# EAGLE design VIC-MIDI_v1.0b (EAGLE 7.6.0)
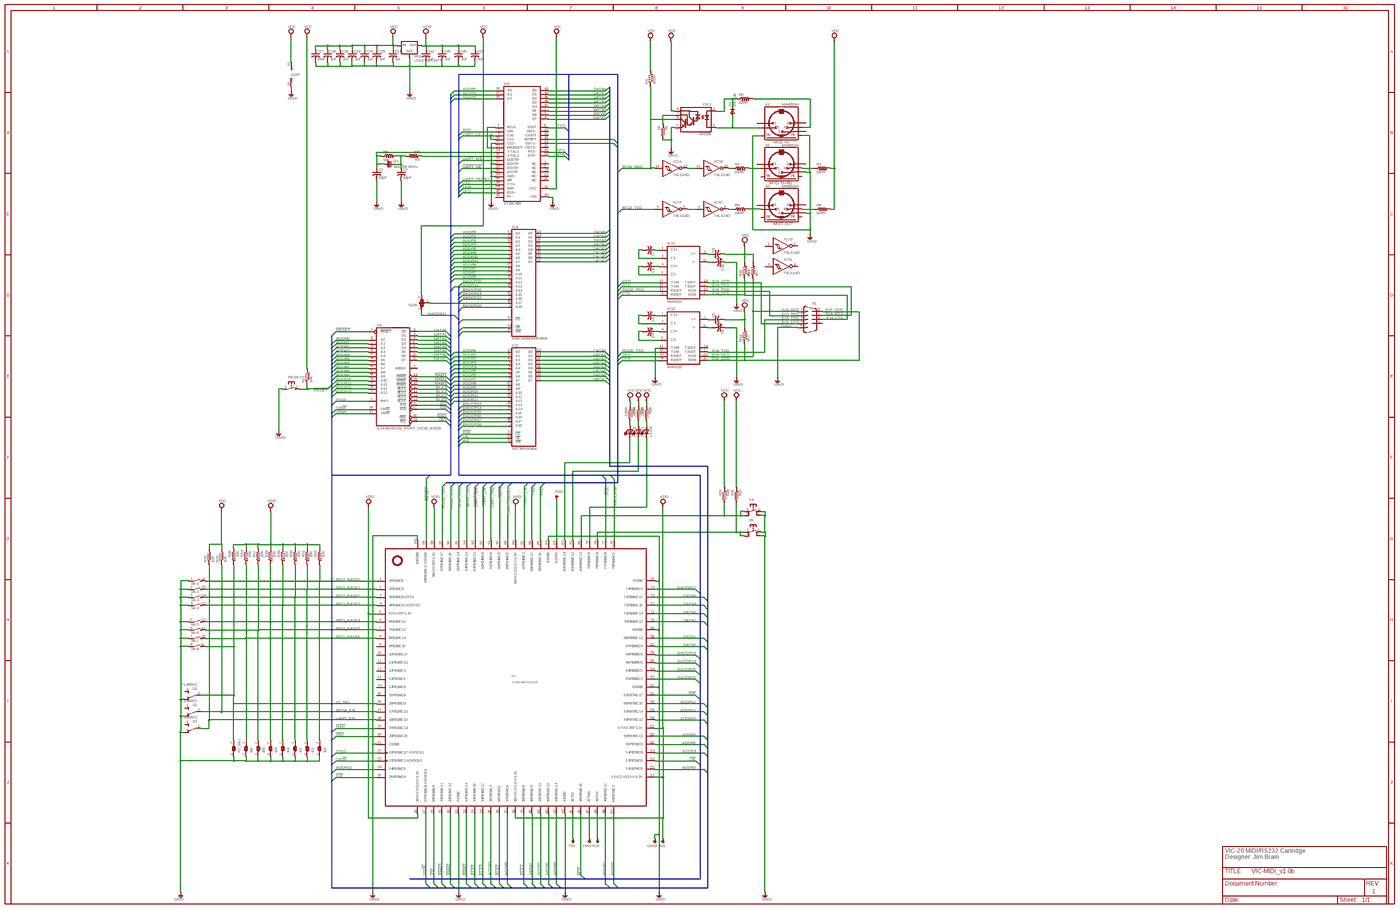
[diagram p0: schematic, sheet 1, overview]
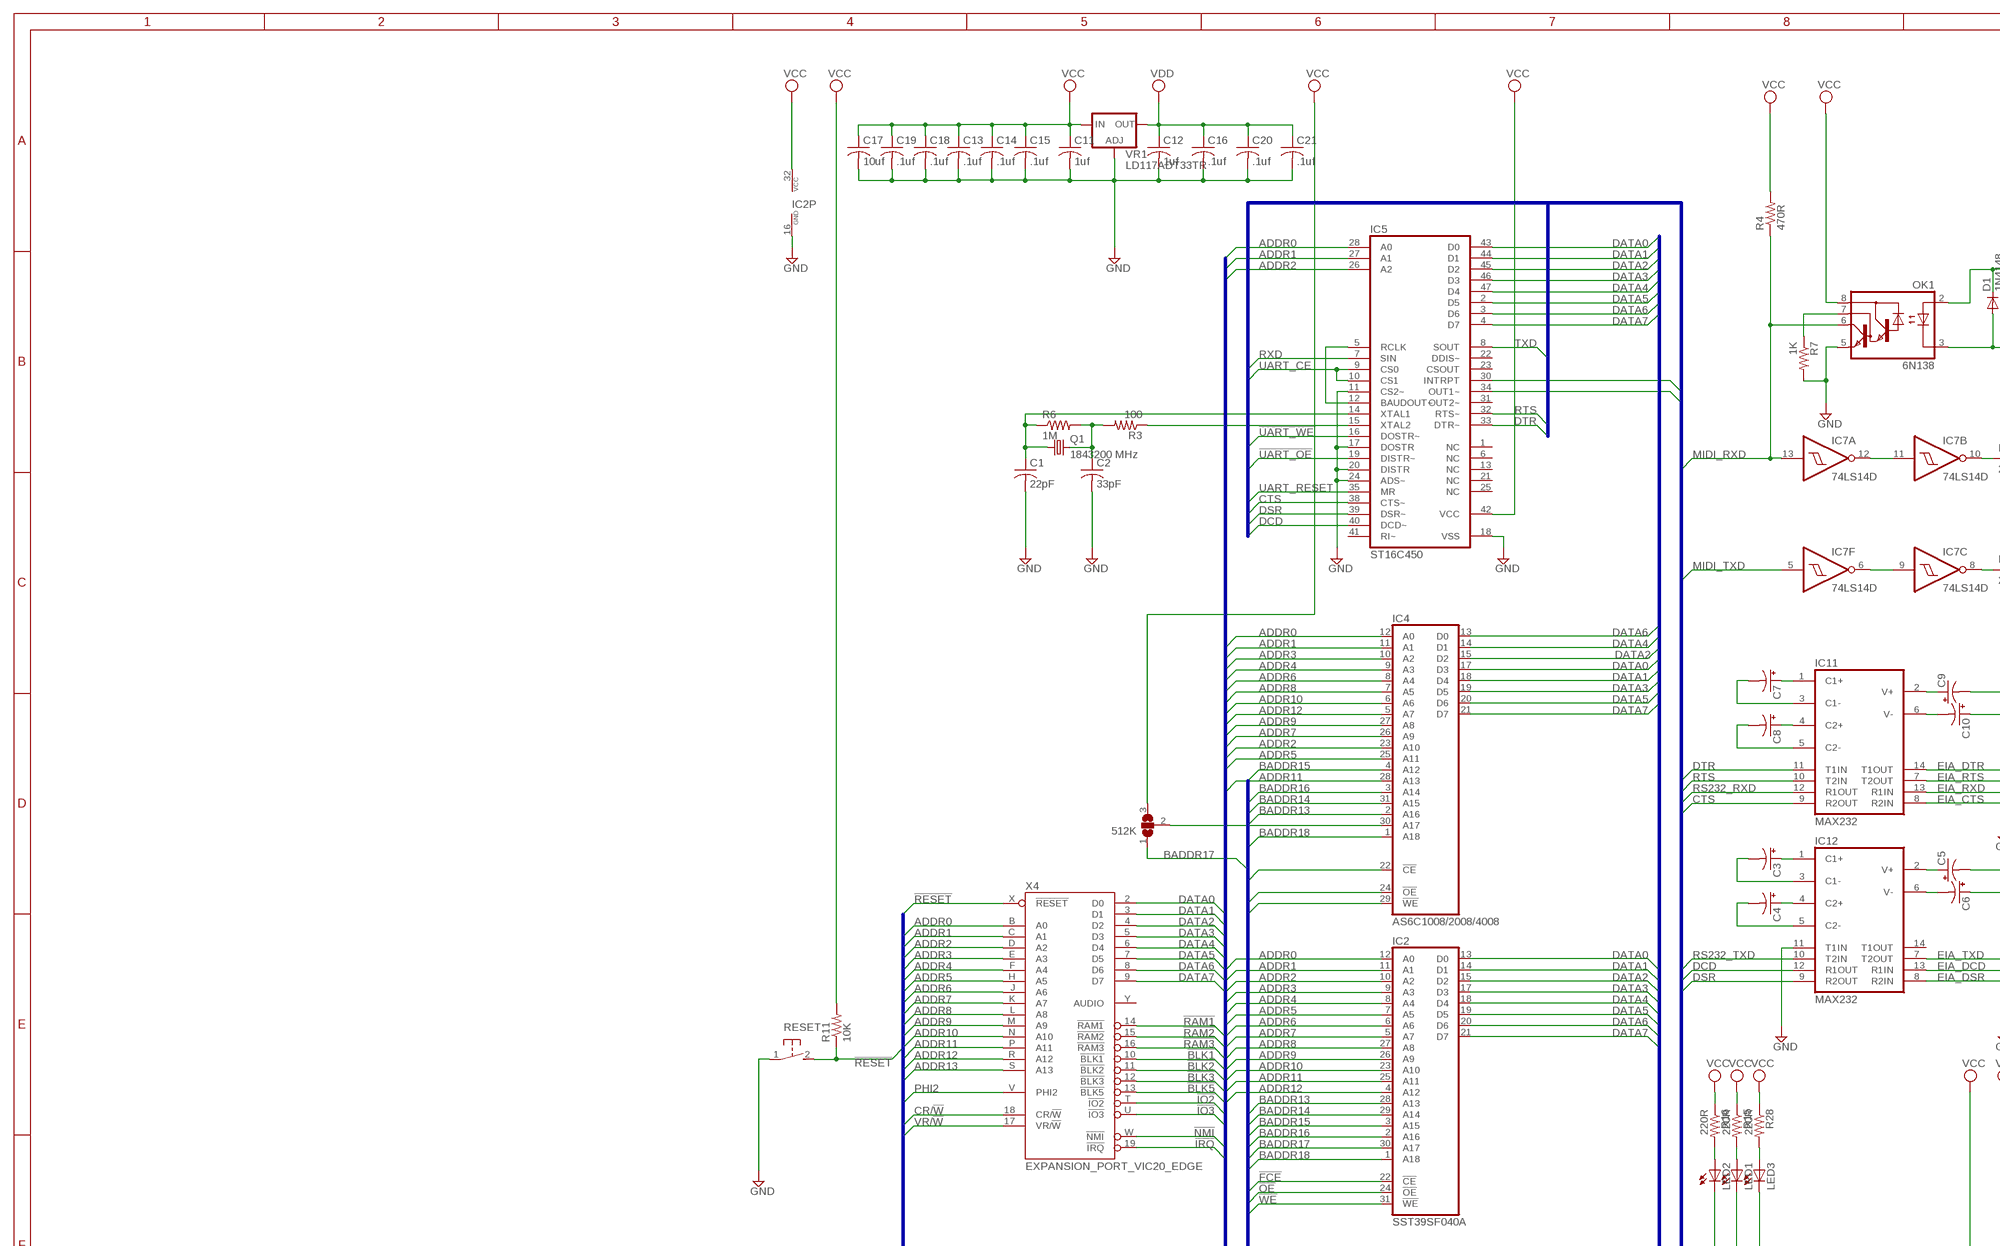
[diagram p1: schematic, sheet 1, part 1 of 4]
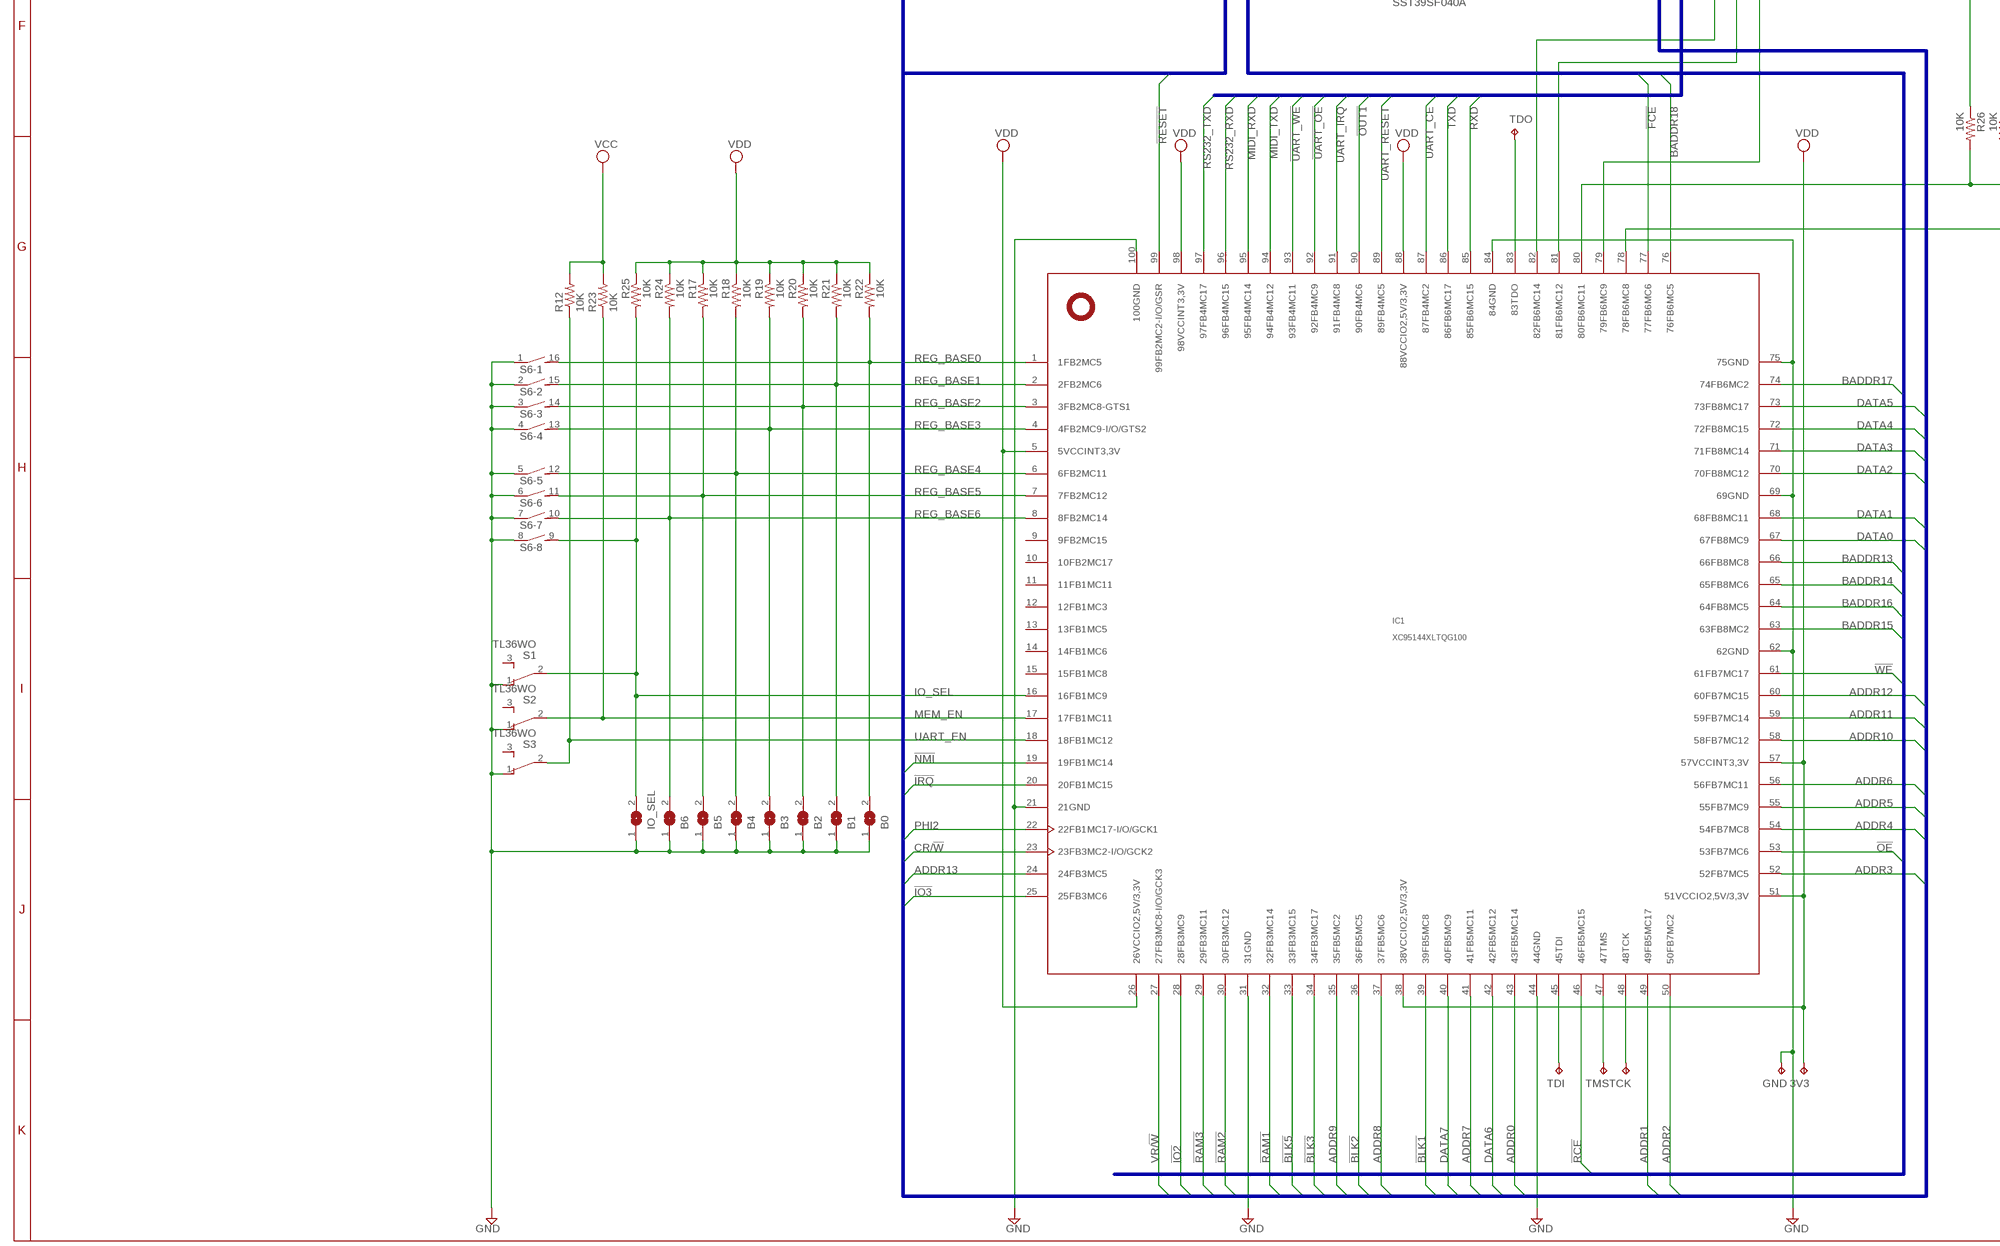
[diagram p2: schematic, sheet 1, part 2 of 4]
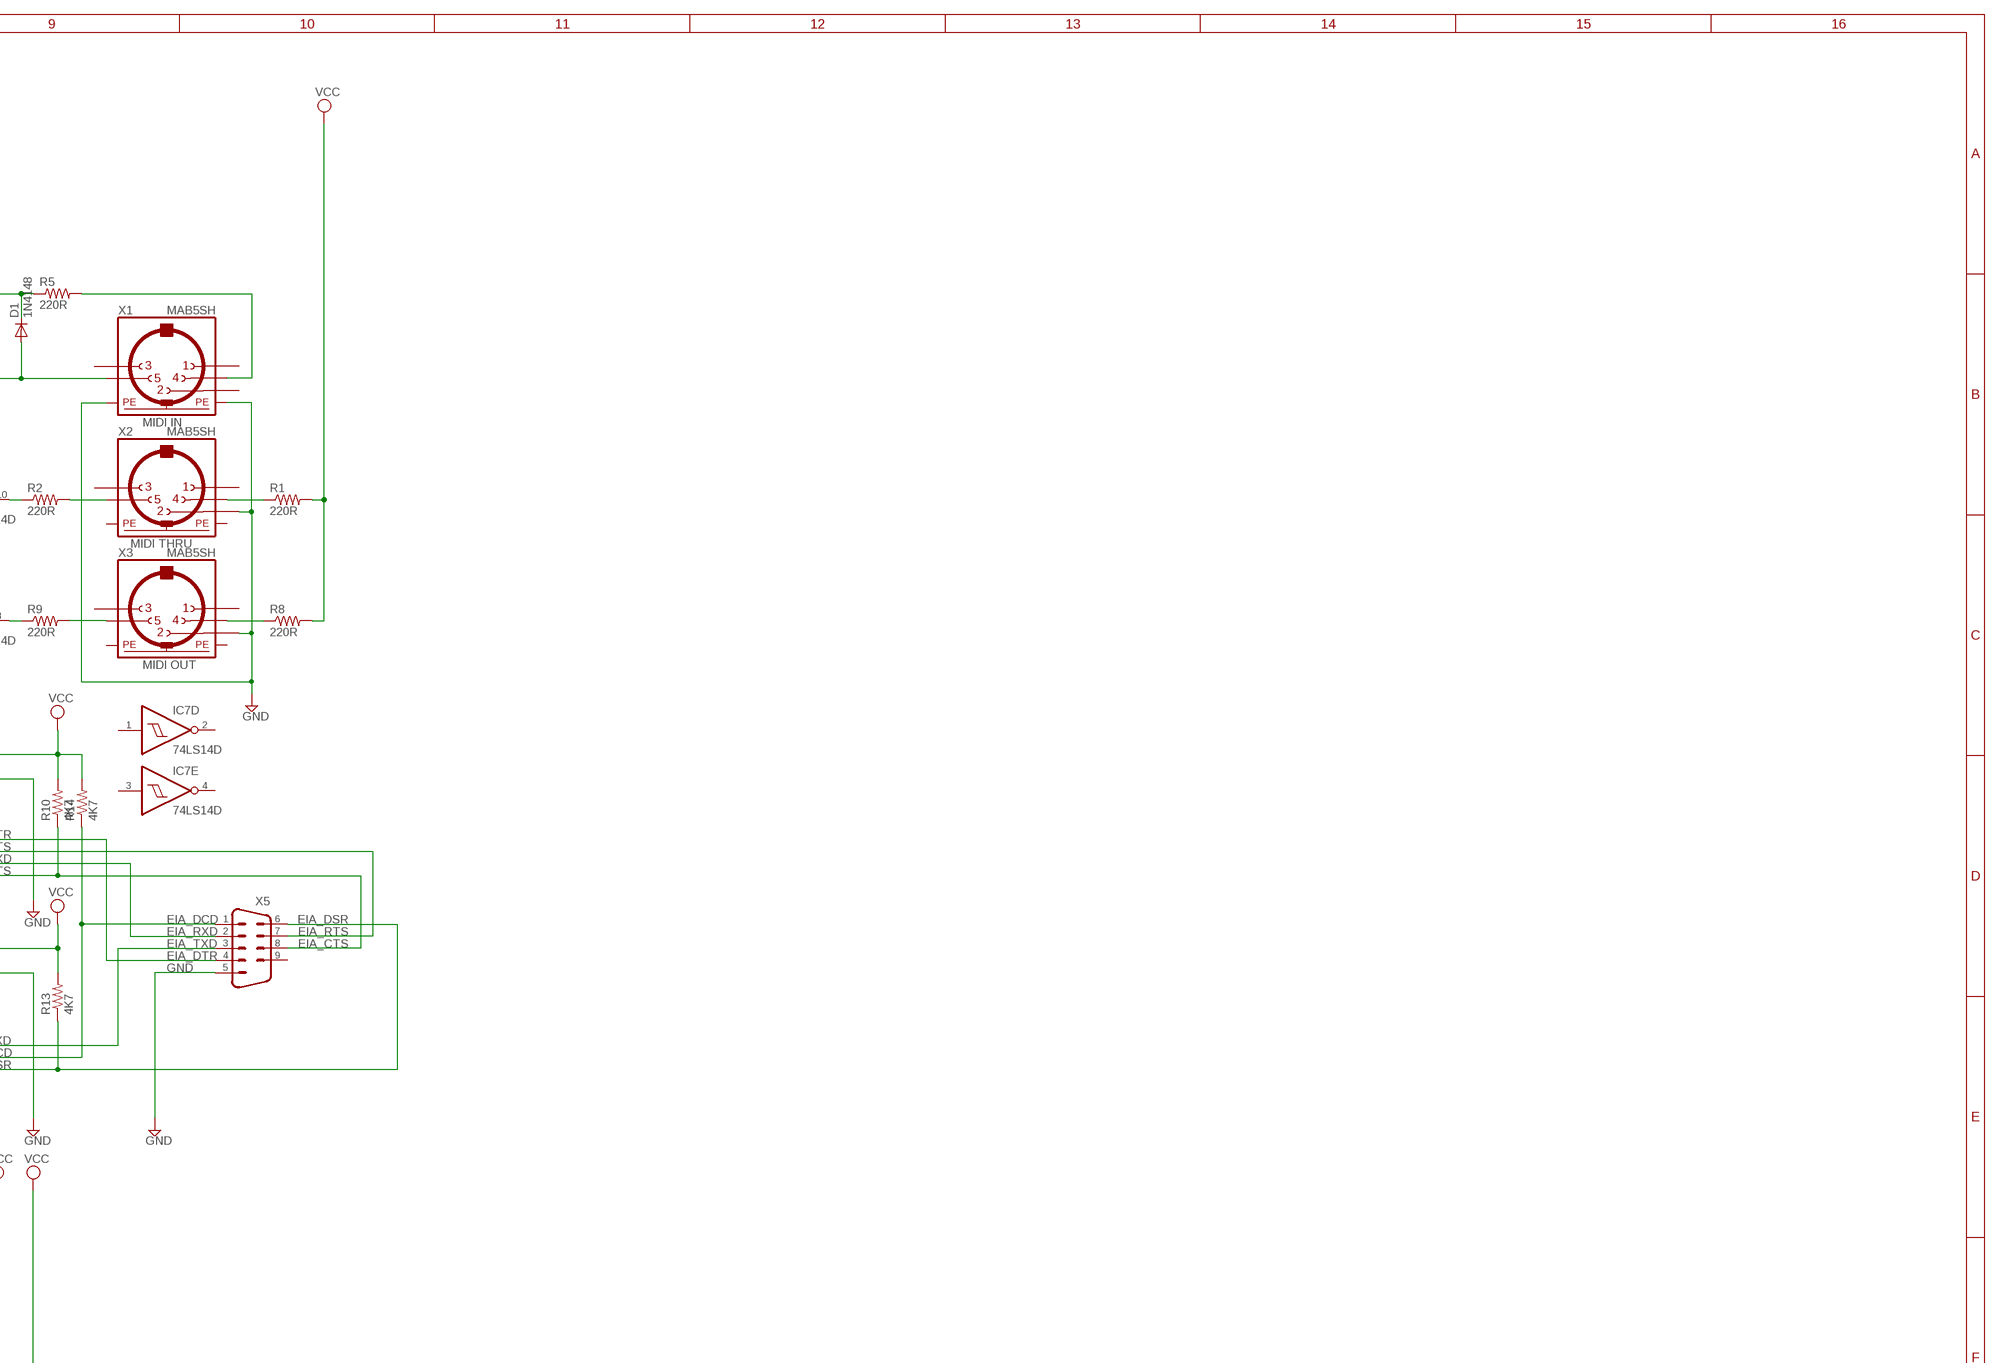
[diagram p3: schematic, sheet 1, part 3 of 4]
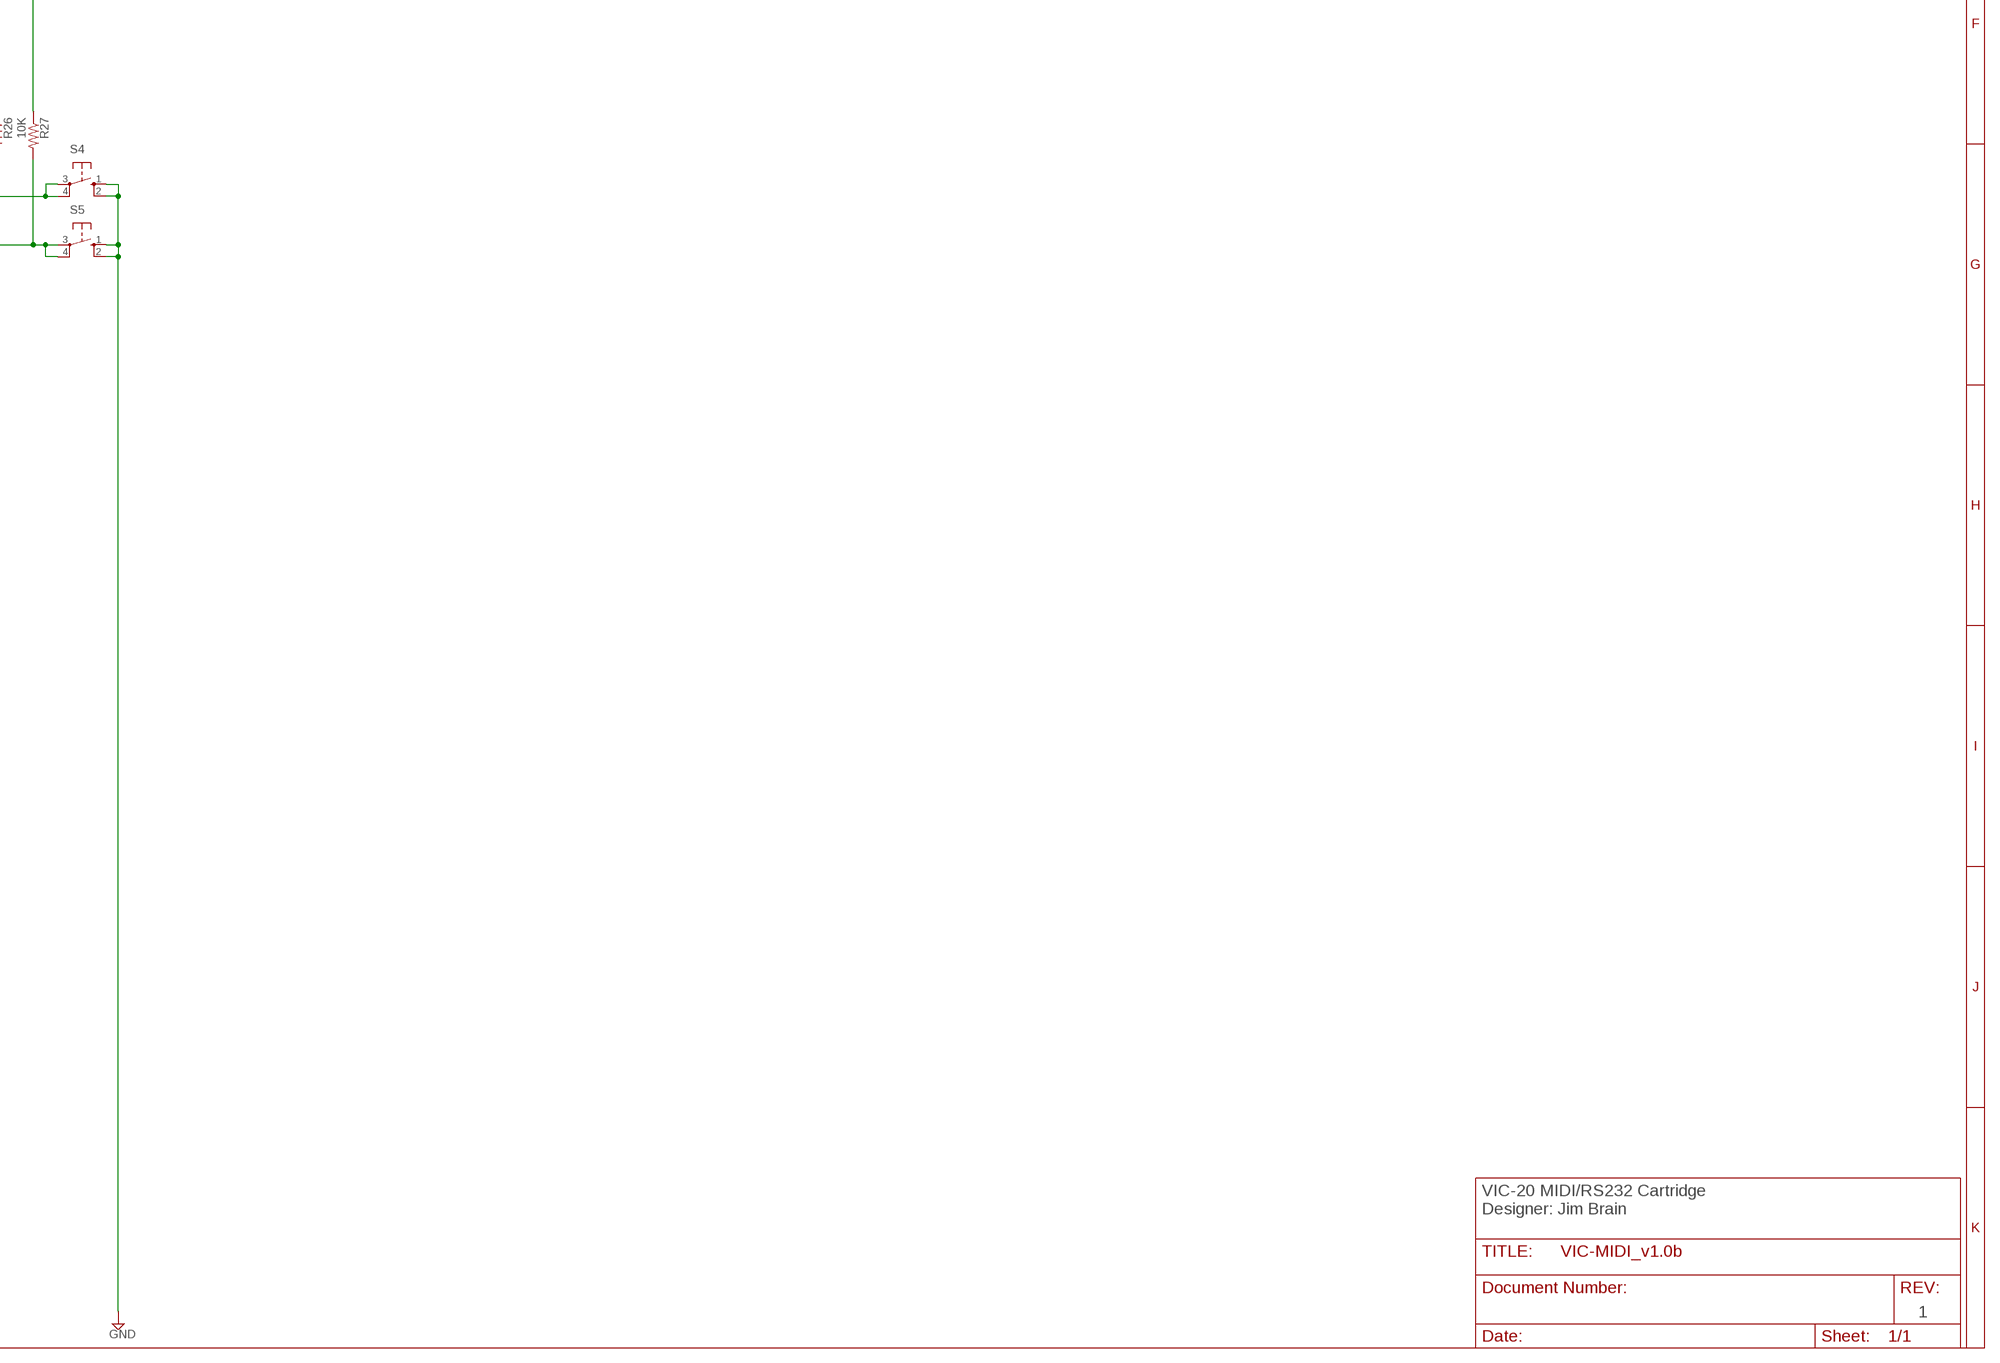
[diagram p4: schematic, sheet 1, part 4 of 4]

## Parts
3V3  TPTP08R  [TP08R]
512K  SJ2W  [SJ_2]
B0  SJ  [SJ]
B1  SJ  [SJ]
B2  SJ  [SJ]
B3  SJ  [SJ]
B4  SJ  [SJ]
B5  SJ  [SJ]
B6  SJ  [SJ]
C1  22pF  C-USC0402  [C0402]
C2  33pF  C-USC0402  [C0402]
C3  CPOL-USE2-4  [E2-4]
C4  CPOL-USE2-4  [E2-4]
C5  CPOL-USE2-4  [E2-4]
C6  CPOL-USE2-4  [E2-4]
C7  CPOL-USE2-4  [E2-4]
C8  CPOL-USE2-4  [E2-4]
C9  CPOL-USE2-4  [E2-4]
C10  CPOL-USE2-4  [E2-4]
C11  1uf  C-USC0402  [C0402]
C12  1uf  C-USC0402  [C0402]
C13  .1uf  C-USC0402  [C0402]
C14  .1uf  C-USC0402  [C0402]
C15  .1uf  C-USC0402  [C0402]
C16  .1uf  C-USC0402  [C0402]
C17  10uf  C-USC0402  [C0402]
C18  .1uf  C-USC0402  [C0402]
C19  .1uf  C-USC0402  [C0402]
C20  .1uf  C-USC0402  [C0402]
C21  .1uf  C-USC0402  [C0402]
D1  1N4148  1N4148DO35-7  [DO35-7]
GND  TPTP08R  [TP08R]
IC1  XC95144XLTQG100  [TQFP100]
IC2  SST39SF040A  AM29F040J  [PLCC32R]
IC4  AS6C1008/2008/4008  AS6C4008  [SOP32L]
IC5  ST16C450  XR-16C450Q  [TQFP48]
IC7  74LS14D  [SO14]
IC11  MAX232  [DIL16]
IC12  MAX232  [DIL16]
IO_SEL  SJ  [SJ]
LED1  LED3MM  [LED3MM]
LED2  LED3MM  [LED3MM]
LED3  LED3MM  [LED3MM]
OK1  6N138  [DIL08]
Q1  1843200 MHz  CRYSTALHC49UP  [HC49UP]
R1  220R  R-US_R0402  [R0402]
R2  220R  R-US_R0402  [R0402]
R3  100  R-US_R0402  [R0402]
R4  470R  R-US_R0402  [R0402]
R5  220R  R-US_R0402  [R0402]
R6  1M  R-US_R0402  [R0402]
R7  1K  R-US_R0402  [R0402]
R8  220R  R-US_R0402  [R0402]
R9  220R  R-US_R0402  [R0402]
R10  4K7  R-US_R0402  [R0402]
R11  10K  R-US_R0402  [R0402]
R12  10K  R-US_R0402  [R0402]
R13  4K7  R-US_R0402  [R0402]
R14  4K7  R-US_R0402  [R0402]
R15  220R  R-US_R0402  [R0402]
R16  220R  R-US_R0402  [R0402]
R17  10K  R-US_R0402  [R0402]
R18  10K  R-US_R0402  [R0402]
R19  10K  R-US_R0402  [R0402]
R20  10K  R-US_R0402  [R0402]
R21  10K  R-US_R0402  [R0402]
R22  10K  R-US_R0402  [R0402]
R23  10K  R-US_R0402  [R0402]
R24  10K  R-US_R0402  [R0402]
R25  10K  R-US_R0402  [R0402]
R26  10K  R-US_R0402  [R0402]
R27  10K  R-US_R0402  [R0402]
R28  220R  R-US_R0402  [R0402]
RESET  31-XX  [B3F-31XX]
S1  TL36WO  [TL3XWO]
S2  TL36WO  [TL3XWO]
S3  TL36WO  [TL3XWO]
S4  10-XX  [B3F-10XX]
S5  10-XX  [B3F-10XX]
S6  DIP08SB  [DIP08SB]
TCK  TPTP08R  [TP08R]
TDI  TPTP08R  [TP08R]
TDO  TPTP08R  [TP08R]
TMS  TPTP08R  [TP08R]
VR1  LD117ADT33TR  [DPACK]
X1  MAB5SH  [MAB5SH]
X2  MAB5SH  [MAB5SH]
X3  MAB5SH  [MAB5SH]
X4  EXPANSION_PORT_VIC20_EDGE  [MA156-22-2]
X5  M09HP  [M09HP]

## Nets
!BLK1: IC1.39(39FB5MC8) X4.10(!BLK1)
!BLK2: IC1.36(36FB5MC5) X4.11(!BLK2)
!BLK3: IC1.34(34FB3MC17) X4.12(!BLK3)
!BLK5: IC1.33(33FB3MC15) X4.13(!BLK5)
!FCE: IC1.77(77FB6MC6) IC2.22(!CE)
!IO2: IC1.28(28FB3MC9) X4.T(!IO2)
!IO3: IC1.25(25FB3MC6) X4.U(!IO3)
!IRQ: IC1.20(20FB1MC15) X4.19(!IRQ)
!NMI: IC1.19(19FB1MC14) X4.W(!NMI)
!OE: IC1.53(53FB7MC6) IC2.24(!OE) IC4.24(!OE)
!OUT1: IC1.90(90FB4MC6) IC5.34(OUT1~)
!RAM1: IC1.32(32FB3MC14) X4.14(!RAM1)
!RAM2: IC1.30(30FB3MC12) X4.15(!RAM2)
!RAM3: IC1.29(29FB3MC11) X4.16(!RAM3)
!RCE: IC1.46(46FB5MC15) IC4.22(!CE)
!RESET: IC1.99(99FB2MC2-I/O/GSR) R11.1 RESET.2(S) X4.X(!RESET)
!UART_OE: IC1.92(92FB4MC9) IC5.19(DISTR~)
!UART_WE: IC1.93(93FB4MC11) IC5.16(DOSTR~)
!WE: IC1.61(61FB7MC17) IC2.31(!WE) IC4.29(!WE)
ADDR0: IC1.43(43FB5MC14) IC2.12(A0) IC4.12(A0) IC5.28(A0) X4.B(A0)
ADDR1: IC1.49(49FB5MC17) IC2.11(A1) IC4.11(A1) IC5.27(A1) X4.C(A1)
ADDR2: IC1.50(50FB7MC2) IC2.10(A2) IC4.23(A10) IC5.26(A2) X4.D(A2)
ADDR3: IC1.52(52FB7MC5) IC2.9(A3) IC4.10(A2) X4.E(A3)
ADDR4: IC1.54(54FB7MC8) IC2.8(A4) IC4.9(A3) X4.F(A4)
ADDR5: IC1.55(55FB7MC9) IC2.7(A5) IC4.25(A11) X4.H(A5)
ADDR6: IC1.56(56FB7MC11) IC2.6(A6) IC4.8(A4) X4.J(A6)
ADDR7: IC1.41(41FB5MC11) IC2.5(A7) IC4.26(A9) X4.K(A7)
ADDR8: IC1.37(37FB5MC6) IC2.27(A8) IC4.7(A5) X4.L(A8)
ADDR9: IC1.35(35FB5MC2) IC2.26(A9) IC4.27(A8) X4.M(A9)
ADDR10: IC1.58(58FB7MC12) IC2.23(A10) IC4.6(A6) X4.N(A10)
ADDR11: IC1.59(59FB7MC14) IC2.25(A11) IC4.28(A13) X4.P(A11)
ADDR12: IC1.60(60FB7MC15) IC2.4(A12) IC4.5(A7) X4.R(A12)
ADDR13: IC1.24(24FB3MC5) X4.S(A13)
BADDR13: IC1.66(66FB8MC8) IC2.28(A13) IC4.2(A16)
BADDR14: IC1.65(65FB8MC6) IC2.29(A14) IC4.31(A15)
BADDR15: IC1.63(63FB8MC2) IC2.3(A15) IC4.4(A12)
BADDR16: IC1.64(64FB8MC5) IC2.2(A16) IC4.3(A14)
BADDR17: 512K.1 IC1.74(74FB6MC2) IC2.30(A17)
BADDR18: IC1.76(76FB6MC5) IC2.1(A18) IC4.1(A18)
CR/!W: IC1.23(23FB3MC2-I/O/GCK2) X4.18(CR/!W)
CTS: IC5.38(CTS~) IC11.9(R2OUT)
DATA0: IC1.67(67FB8MC9) IC2.13(D0) IC4.17(D3) IC5.43(D0) X4.2(D0)
DATA1: IC1.68(68FB8MC11) IC2.14(D1) IC4.18(D4) IC5.44(D1) X4.3(D1)
DATA2: IC1.70(70FB8MC12) IC2.15(D2) IC4.15(D2) IC5.45(D2) X4.4(D2)
DATA3: IC1.71(71FB8MC14) IC2.17(D3) IC4.19(D5) IC5.46(D3) X4.5(D3)
DATA4: IC1.72(72FB8MC15) IC2.18(D4) IC4.14(D1) IC5.47(D4) X4.6(D4)
DATA5: IC1.73(73FB8MC17) IC2.19(D5) IC4.20(D6) IC5.2(D5) X4.7(D5)
DATA6: IC1.42(42FB5MC12) IC2.20(D6) IC4.13(D0) IC5.3(D6) X4.8(D6)
DATA7: IC1.40(40FB5MC9) IC2.21(D7) IC4.21(D7) IC5.4(D7) X4.9(D7)
DCD: IC5.40(DCD~) IC12.12(R1OUT)
DSR: IC5.39(DSR~) IC12.9(R2OUT)
DTR: IC5.33(DTR~) IC11.11(T1IN)
EIA_CTS: IC11.8(R2IN) R10.1 X5.8
EIA_DCD: IC12.13(R1IN) R14.1 X5.1
EIA_DSR: IC12.8(R2IN) R13.1 X5.6
EIA_DTR: IC11.14(T1OUT) X5.4
EIA_RTS: IC11.7(T2OUT) X5.7
EIA_RXD: IC11.13(R1IN) X5.2
EIA_TXD: IC12.7(T2OUT) X5.3
GND: B0.1 B1.1 B2.1 B3.1 B4.1 B5.1 B6.1 C1.2 C2.2 C6.+ C10.+ C11.2 C12.2 C13.2 C14.2 C15.2 C16.2 C17.2 C18.2 C19.2 C20.2 C21.2 GND.TP IC1.21(21GND) IC1.31(31GND) IC1.44(44GND) IC1.62(62GND) IC1.69(69GND) IC1.75(75GND) IC1.84(84GND) IC1.100(100GND) IC2.16(GND) IC5.11(CS2~) IC5.17(DOSTR) IC5.18(VSS) IC5.20(DISTR) IC5.24(ADS~) IC12.11(T1IN) IO_SEL.1 OK1.5(GND) R7.2 RESET.1(P) S1.1(O) S2.1(O) S3.1(O) S4.1(S) S4.2(S1) S5.1(S) S5.2(S1) S6.1 S6.2 S6.3 S6.4 S6.5 S6.6 S6.7 S6.8 VR1.1(ADJ) X1.PE X1.PE@(PE) X2.2 X3.2 X5.5
IO_SEL: IC1.16(16FB1MC9) IO_SEL.2 R25.2 S1.2(P) S6.9
MEM_EN: IC1.17(17FB1MC11) R23.1 S2.2(P)
MIDI_RXD: IC1.95(95FB4MC14) IC7.13(A:I) OK1.6(VO) R4.1
MIDI_TXD: IC1.94(94FB4MC12) IC7.5(F:I)
N$1: R9.2 X3.5
N$2: IC7.6(F:O) IC7.9(C:I)
N$3: R8.1 X3.4
N$4: IC7.8(C:O) R9.1
N$5: LED1.A R15.2
N$6: D1.C OK1.2(A) R5.1
N$7: R5.2 X1.4
N$8: D1.A OK1.3(C) X1.5
N$9: OK1.7(VB) R7.1
N$10: R2.2 X2.5
N$11: IC7.10(B:O) R2.1
N$12: IC7.11(B:I) IC7.12(A:O)
N$13: R1.1 X2.4
N$14: IC1.78(78FB6MC8) R27.2 S5.3(P) S5.4(P1)
N$15: IC5.15(XTAL2) R3.1
N$16: C1.1 IC5.14(XTAL1) Q1.1 R6.1
N$17: C2.1 Q1.2 R3.2 R6.2
N$18: IC1.81(81FB6MC12) LED1.K(C)
N$19: IC5.5(RCLK) IC5.12(BAUDOUT~)
N$20: IC1.80(80FB6MC11) R26.2 S4.3(P) S4.4(P1)
N$21: IC1.82(82FB6MC14) LED2.K(C)
N$22: LED3.A R28.2
N$23: IC1.79(79FB6MC9) LED3.K(C)
N$25: LED2.A R16.2
N$27: IC1.48(48TCK) TCK.TP
N$31: IC1.47(47TMS) TMS.TP
N$32: IC1.45(45TDI) TDI.TP
N$33: IC1.83(83TDO) TDO.TP
N$36: C3.+ IC12.1(C1+)
N$37: C3.- IC12.3(C1-)
N$38: C4.+ IC12.4(C2+)
N$39: C4.- IC12.5(C2-)
N$40: C5.+ IC12.2(V+)
N$41: C6.- IC12.6(V-)
N$42: C7.+ IC11.1(C1+)
N$43: C7.- IC11.3(C1-)
N$44: C8.+ IC11.4(C2+)
N$45: C8.- IC11.5(C2-)
N$46: C9.+ IC11.2(V+)
N$47: C10.- IC11.6(V-)
N$48: 512K.2 IC4.30(A17)
PHI2: IC1.22(22FB1MC17-I/O/GCK1) X4.V(PHI2)
REG_BASE0: B0.2 IC1.1(1FB2MC5) R22.2 S6.16
REG_BASE1: B1.2 IC1.2(2FB2MC6) R21.2 S6.15
REG_BASE2: B2.2 IC1.3(3FB2MC8-GTS1) R20.2 S6.14
REG_BASE3: B3.2 IC1.4(4FB2MC9-I/O/GTS2) R19.2 S6.13
REG_BASE4: B4.2 IC1.6(6FB2MC11) R18.2 S6.12
REG_BASE5: B5.2 IC1.7(7FB2MC12) R17.2 S6.11
REG_BASE6: B6.2 IC1.8(8FB2MC14) R24.2 S6.10
RS232_RXD: IC1.96(96FB4MC15) IC11.12(R1OUT)
RS232_TXD: IC1.97(97FB4MC17) IC12.10(T2IN)
RTS: IC5.32(RTS~) IC11.10(T2IN)
RXD: IC1.85(85FB6MC15) IC5.7(SIN)
TXD: IC1.86(86FB6MC17) IC5.8(SOUT)
UART_CE: IC1.87(87FB4MC2) IC5.9(CS0) IC5.10(CS1)
UART_EN: IC1.18(18FB1MC12) R12.1 S3.2(P)
UART_IRQ: IC1.91(91FB4MC8) IC5.30(INTRPT)
UART_RESET: IC1.89(89FB4MC5) IC5.35(MR)
VCC: 512K.3 C5.- C9.- C11.1 C13.1 C14.1 C15.1 C17.1 C18.1 C19.1 IC2.32(VCC) IC5.42(VCC) OK1.8(VCC) R1.2 R4.2 R8.2 R10.2 R11.2 R12.2 R13.2 R14.2 R15.1 R16.1 R23.2 R26.1 R27.1 R28.1 VR1.3(IN)
VDD: 3V3.TP C12.1 C16.1 C20.1 C21.1 IC1.5(5VCCINT3,3V) IC1.26(26VCCIO2,5V/3,3V) IC1.38(38VCCIO2,5V/3,3V) IC1.51(51VCCIO2,5V/3,3V) IC1.57(57VCCINT3,3V) IC1.88(88VCCIO2,5V/3,3V) IC1.98(98VCCINT3,3V) R17.1 R18.1 R19.1 R20.1 R21.1 R22.1 R24.1 R25.1 VR1.4(OUT)
VR/!W: IC1.27(27FB3MC8-I/O/GCK3) X4.17(VR/!W)
Unconnected: IC1.9(9FB2MC15) IC1.10(10FB2MC17) IC1.11(11FB1MC11) IC1.12(12FB1MC3) IC1.13(13FB1MC5) IC1.14(14FB1MC6) IC1.15(15FB1MC8) IC5.1(NC) IC5.6(NC) IC5.13(NC) IC5.21(NC) IC5.22(DDIS~) IC5.23(CSOUT) IC5.25(NC) IC5.31(OUT2~) IC5.41(RI~) IC7.1(D:I) IC7.2(D:O) IC7.3(E:I) IC7.4(E:O) IC12.14(T1OUT) S1.3(S) S2.3(S) S3.3(S) X1.1 X1.2 X1.3 X2.1 X2.3 X3.1 X3.3 X4.Y(AUDIO) X5.9

## Buses
DATA[0..7],ADDR[0..13],VR/!W,CR/!W,!BLK1,!BLK2,!BLK3,!BLK5,!RAM1,!RAM2,!RAM3,!IRQ,!NMI,!IO2,!IO3,PHI2,!RESET
RXD,TXD,DCD,RTS,CTS,DSR,DTR,MIDI_RXD,MIDI_TXD,RS232_RXD,RS232_TXD,UART_CE,!UART_WE,!UART_OE,UART_RESET,!OUT1,UART_IRQ
BADDR[13..19],!FCE,!OE,!WE,!RCE

## Notes on the sheet
- MIDI IN
- MIDI THRU
- MIDI OUT
- VIC-20 MIDI/RS232 Cartridge
- Designer: Jim Brain
- 1

## Power pins joined to a net without a drawn wire
GND: IC4.16(GND) IC7.7(P:GND) IC11.15(GND) IC12.15(GND) X4.1(GND) X4.22(GND) X4.A(GND) X4.Z(GND)
PE: X2.PE X2.PE@(PE) X3.PE X3.PE@(PE)
VCC: IC4.32(VCC) IC7.14(P:VCC) IC11.16(VCC) IC12.16(VCC) X4.21(VCC)

## Library data of the parts
3V3 GND TCK TDI TDO TMS = testpad:TP: Test pad
512K = jumper:SJ2W: SMD solder JUMPER
B0 B1-B6 IO_SEL = jumper:SJ: SMD solder JUMPER
C1 C2 C11-C21 = rcl:C-US: CAPACITOR, American symbol
C3-C10 = rcl:CPOL-US: POLARIZED CAPACITOR, American symbol
D1 = diode:1N4148: DIODE high speed (Philips)
IC1 = xilinx_xc95XXXxl:XC95144XLTQG100
IC2 = am29-memory:AM29F040J: 4-Megabit FLASH MEMORY (512 K x 8 bit) 5 V-only
IC4 = memory--alliance:AS6C4008
IC5 = exar:XR-16C450Q: UART
IC7 = 74xx-us:74*14: Hex schmitt trigger INVERTER
IC11 IC12 = maxim:MAX232: RS232 TRANSEIVER; MF: MAXIM; MPN: MAX232ACPE+; OC_FARNELL: 9723773; OC_NEWARK: 68K4544
LED1-LED3 = led:LED: LED OSRAM: - CHIPLED LG R971, LG N971, LY N971, LG Q971, LY Q971, LO R971, LY R971 LH N974, LH R974 LS Q976, LO Q976, LY Q976 LO Q996 - Hyper CHIPLED LW Q18S LB Q993, LB Q99A, LB R99A - SideLED LS A670, LO A670, LY A670, LG A670, LP A670 LB A673, LV A673, LT A673, LW A673 LH A674 LY A675 LS A676, LA A676, LO A676, LY A676, LW A676 LS A679, LY A679, LG A679 - Hyper Micro SIDELED® LS Y876, LA Y876, LO Y876, LY Y876 LT Y87S - SmartLED LW L88C, LW L88S LB L89C, LB L89S, LG L890 LS L89K, LO L89K, LY L89K LS L896, LA L896, LO L896, LY L896 - TOPLED LS T670, LO T670, LY T670, LG T670, LP T670 LSG T670, LSP T670, LSY T670, LOP T670, LYG T670 LG T671, LOG T671, LSG T671 LB T673, LV T673, LT T673, LW T673 LH T674 LS T676, LA T676, LO T676, LY T676, LB T676, LH T676, LSB T676, LW T676 LB T67C, LV T67C, LT T67C, LS T67K, LO T67K, LY T67K, LW E67C LS E67B, LA E67B, LO E67B, LY E67B, LB E67C, LV E67C, LT E67C LW T67C LS T679, LY T679, LG T679 LS T770, LO T770, LY T770, LG T770, LP T770 LB T773, LV T773, LT T773, LW T773 LH T774 LS E675, LA E675, LY E675, LS T675 LS T776, LA T776, LO T776, LY T776, LB T776 LHGB T686 LT T68C, LB T68C - Hyper Mini TOPLED® LB M676 - Mini TOPLED Santana® LG M470 LS M47K, LO M47K, LY M47K Source: http://www.osram.convergy.de LUXEON: - LUMILED® LXK2-PW12-R00, LXK2-PW12-S00, LXK2-PW14-U00, LXK2-PW14-V00 LXK2-PM12-R00, LXK2-PM12-S00, LXK2-PM14-U00 LXK2-PE12-Q00, LXK2-PE12-R00, LXK2-PE12-S00, LXK2-PE14-T00, LXK2-PE14-U00 LXK2-PB12-K00, LXK2-PB12-L00, LXK2-PB12-M00, LXK2-PB14-N00, LXK2-PB14-P00, LXK2-PB14-Q00 LXK2-PR12-L00, LXK2-PR12-M00, LXK2-PR14-Q00, LXK2-PR14-R00 LXK2-PD12-Q00, LXK2-PD12-R00, LXK2-PD12-S00 LXK2-PH12-R00, LXK2-PH12-S00 LXK2-PL12-P00, LXK2-PL12-Q00, LXK2-PL12-R00 Source: www.luxeon.com KINGBRIGHT: KA-3528ASYC Source: www.kingbright.com
OK1 = optocoupler:6N138: MOTOROLA OPTO COUPLER; MF: VISHAY/TELEFUNKEN; MPN: 6N138; OC_FARNELL: 9860150; OC_NEWARK: 35K5294
Q1 = crystal:CRYSTAL: CRYSTAL; OC_FARNELL: unknown; OC_NEWARK: unknown
R1-R9 R11 R12 R15-R28 = resistor:R-US_: RESISTOR, American symbol
R10 R13 R14 = rcl:R-US_: RESISTOR, American symbol
RESET = switch-omron:31-XX: OMRON SWITCH; MPN: B3F-3100; OC_FARNELL: 959704; OC_NEWARK: 36M3582
S1-S3 = switch:TL36WO: TINY SWITCH ON - ON Source: http://www2.produktinfo.conrad.com/datenblaetter/700000-724999/705152-da-01-de-Subminiaturschalter_TL_36WO.pdf
S4 S5 = switch-omron:10-XX: OMRON SWITCH; MPN: B3F-1000; OC_FARNELL: 176432; OC_NEWARK: 36M3542
S6 = switch-dil:DIP08SB: DIL/CODE SWITCH; OC_FARNELL: unknown; OC_NEWARK: unknown
VR1 = v-reg:LD117A?*: Low drop fixed and adjustable positive voltage regulators 1 A Source: http://www.st.com/stonline/products/literature/ds/7194/ld1117axx.pdf
X1-X3 = con-hirschmann:MAB5SH: Female CONNECTOR 5 pins 90 deg. with shield, horizontal (DIN 41524); OC_FARNELL: 809883; OC_NEWARK: unknown
X4 = commodore:EXPANSION_PORT_VIC20_EDGE: Expansionport of the Commodore VIC-20
X5 = con-subd:M09: SUB-D; OC_FARNELL: unknown; OC_NEWARK: unknown

## Board
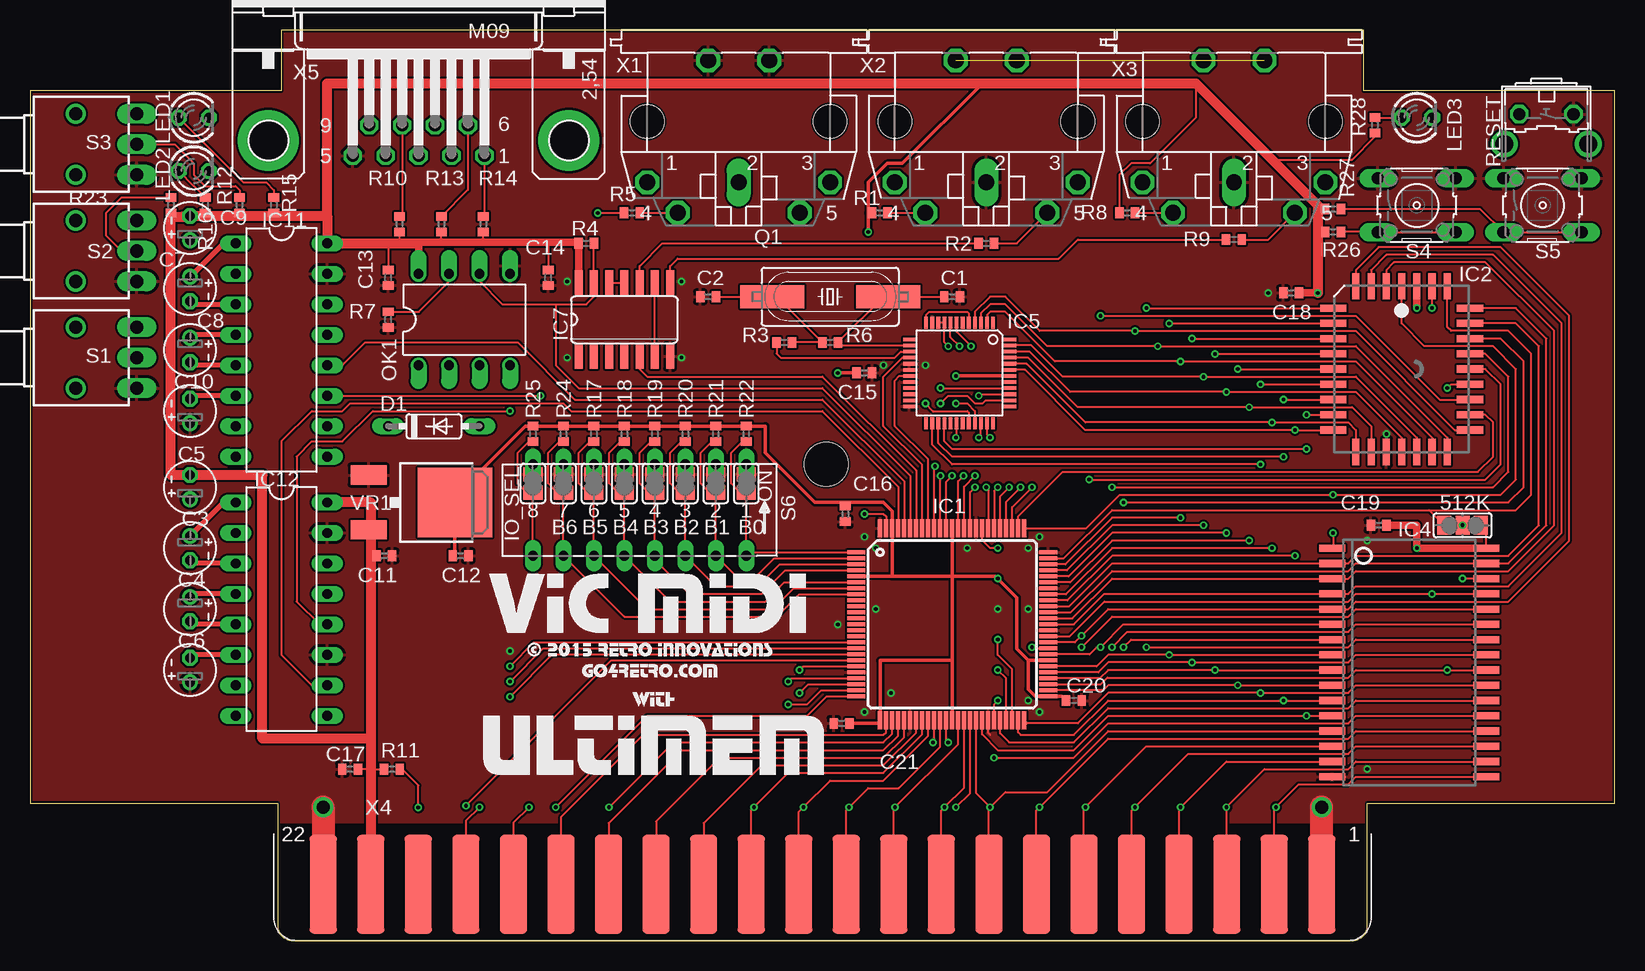
[diagram p5: board, top side]
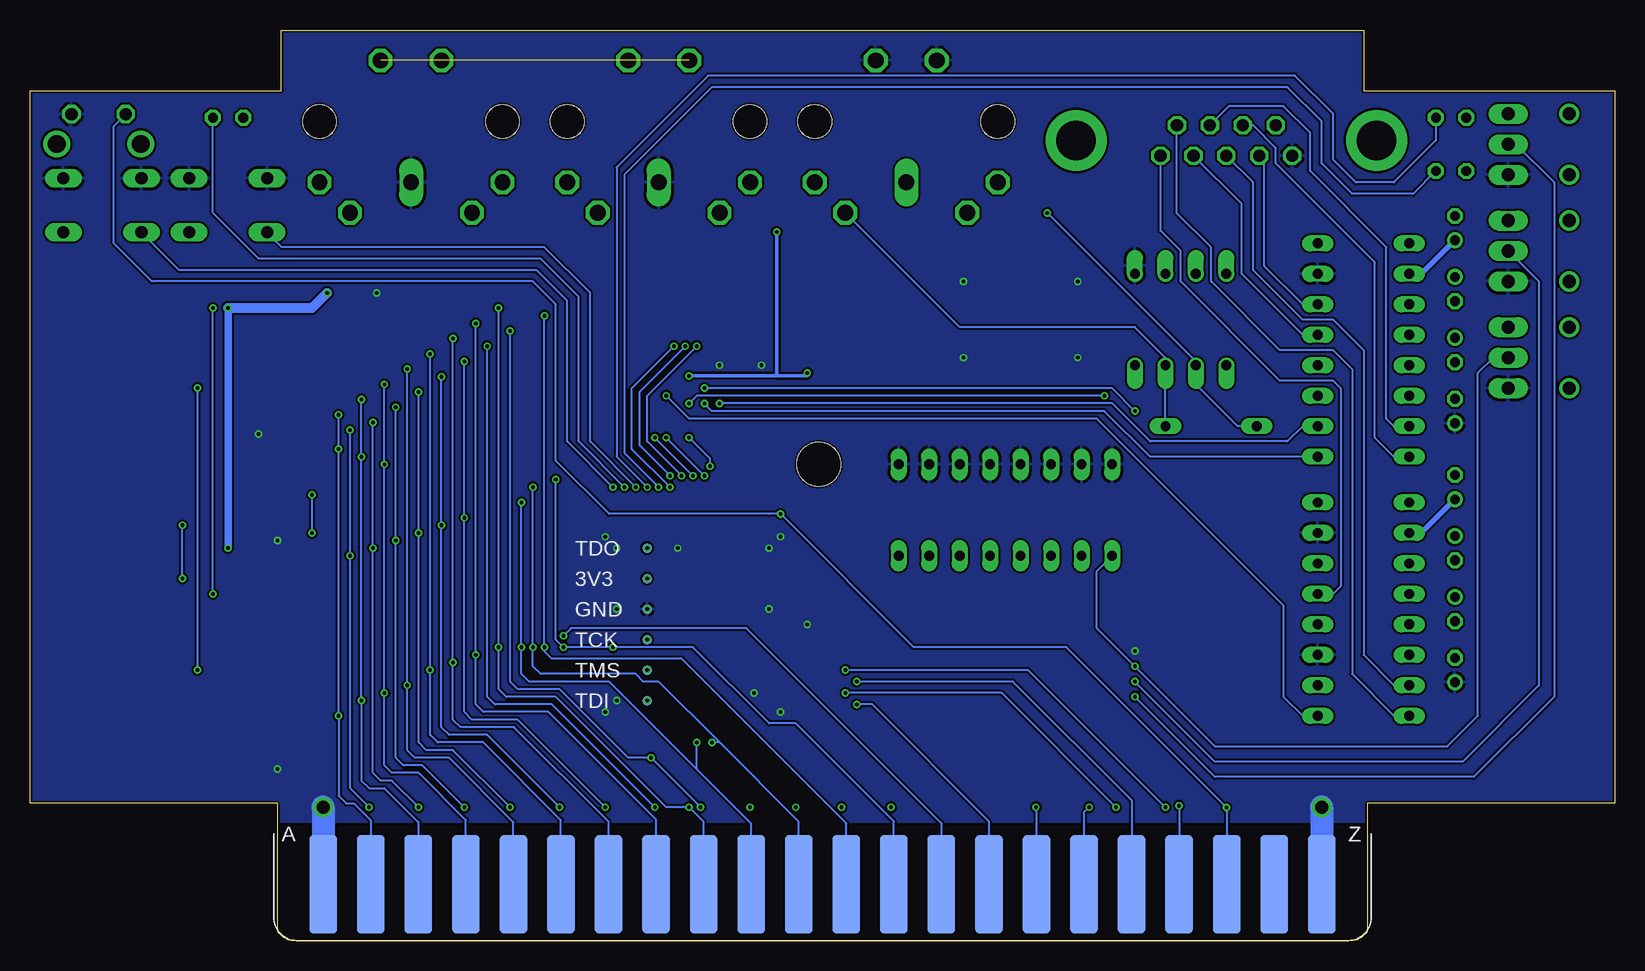
[diagram p6: board, bottom side, seen from below]

Size 132.08 x 75.88 mm. Coordinates in mm from the lower left corner, seen from the top.
Outline: 20.64,1.27 arc90 21.91,0 110.17,0 arc90 111.44,1.27 111.44,11.43 132.08,11.43 132.08,70.8 111.12,70.8 111.12,75.88 20.96,75.88 20.96,70.8 0,70.8 0,11.43 20.64,11.43 20.64,1.27
Copper layers (1*16): Top 0.035mm / dielectric 1.5mm / Bottom 0.035mm
Design rules "hackvana": minimum track width 6mil, minimum drill 0.3mm, track to track 6mil, track to pad 6mil, pad to pad 6mil, via to via 6mil, smd to smd 0mil, copper to edge 6mil, drill to drill 6mil, minimum pad ring 10mil, minimum via ring 6mil, stop-mask expansion 2mil, vias tented up to drill 100mil, thermal gap 10mil
Holes 3.64 mm at 66.36,39.69

### Footprints (pad centres in the part's own frame; a part is rotated, then mirrored left to right if it is on the bottom)
TP08R = smd 0.8 x 0.8: TP 0,0
SJ_2 = smd 1.168 x 1.6: 1 -1.524,0; 2 0,0; 3 1.524,0
SJ = smd 1.168 x 1.6: 1 -0.762,0; 2 0.762,0
C0402 = smd 0.7 x 0.9: 1 -0.65,0; 2 0.65,0
E2-4 = drill 0.813 pad 1.27: + -1.016,0 | drill 0.813 pad 1.27 octagon: - 1.016,0
DO35-7 = drill 0.813 long: A 3.81,0; C -3.81,0
TQFP100 = smd 1.5 x 0.35: 1 -8,6; 2 -8,5.5; 3 -8,5; 4 -8,4.5; 5 -8,4; 6 -8,3.5; 7 -8,3; 8 -8,2.5; 9 -8,2; 10 -8,1.5; 11 -8,1; 12 -8,0.5; 13 -8,0; 14 -8,-0.5; 15 -8,-1; 16 -8,-1.5; 17 -8,-2; 18 -8,-2.5; 19 -8,-3; 20 -8,-3.5; 21 -8,-4; 22 -8,-4.5; 23 -8,-5; 24 -8,-5.5; 25 -8,-6; 51 8,-6; 52 8,-5.5; 53 8,-5; 54 8,-4.5; 55 8,-4; 56 8,-3.5; 57 8,-3; 58 8,-2.5; 59 8,-2; 60 8,-1.5; 61 8,-1; 62 8,-0.5; 63 8,0; 64 8,0.5; 65 8,1; 66 8,1.5; 67 8,2; 68 8,2.5; 69 8,3; 70 8,3.5; 71 8,4; 72 8,4.5; 73 8,5; 74 8,5.5; 75 8,6 | smd 0.35 x 1.5: 26 -6,-8; 27 -5.5,-8; 28 -5,-8; 29 -4.5,-8; 30 -4,-8; 31 -3.5,-8; 32 -3,-8; 33 -2.5,-8; 34 -2,-8; 35 -1.5,-8; 36 -1,-8; 37 -0.5,-8; 38 0,-8; 39 0.5,-8; 40 1,-8; 41 1.5,-8; 42 2,-8; 43 2.5,-8; 44 3,-8; 45 3.5,-8; 46 4,-8; 47 4.5,-8; 48 5,-8; 49 5.5,-8; 50 6,-8; 76 6,8; 77 5.5,8; 78 5,8; 79 4.5,8; 80 4,8; 81 3.5,8; 82 3,8; 83 2.5,8; 84 2,8; 85 1.5,8; 86 1,8; 87 0.5,8; 88 0,8; 89 -0.5,8; 90 -1,8; 91 -1.5,8; 92 -2,8; 93 -2.5,8; 94 -3,8; 95 -3.5,8; 96 -4,8; 97 -4.5,8; 98 -5,8; 99 -5.5,8; 100 -6,8
PLCC32R = smd 0.6 x 2.2: 1 0,6.9; 2 -1.27,6.9; 3 -2.54,6.9; 4 -3.81,6.9; 14 -3.81,-6.9; 15 -2.54,-6.9; 16 -1.27,-6.9; 17 0,-6.9; 18 1.27,-6.9; 19 2.54,-6.9; 20 3.81,-6.9; 30 3.81,6.9; 31 2.54,6.9; 32 1.27,6.9 | smd 2.2 x 0.6: 5 -5.7,5.08; 6 -5.7,3.81; 7 -5.7,2.54; 8 -5.7,1.27; 9 -5.7,0; 10 -5.7,-1.27; 11 -5.7,-2.54; 12 -5.7,-3.81; 13 -5.7,-5.08; 21 5.7,-5.08; 22 5.7,-3.81; 23 5.7,-2.54; 24 5.7,-1.27; 25 5.7,0; 26 5.7,1.27; 27 5.7,2.54; 28 5.7,3.81; 29 5.7,5.08
SOP32L = smd 0.6 x 2.2: 1 -9.525,-6.416; 2 -8.255,-6.416; 3 -6.985,-6.416; 4 -5.715,-6.416; 5 -4.445,-6.416; 6 -3.175,-6.416; 7 -1.905,-6.416; 8 -0.635,-6.416; 9 0.635,-6.416; 10 1.905,-6.416; 11 3.175,-6.416; 12 4.445,-6.416; 13 5.715,-6.416; 14 6.985,-6.416; 15 8.255,-6.416; 16 9.525,-6.416; 17 9.525,6.416; 18 8.255,6.416; 19 6.985,6.416; 20 5.715,6.416; 21 4.445,6.416; 22 3.175,6.416; 23 1.905,6.416; 24 0.635,6.416; 25 -0.635,6.416; 26 -1.905,6.416; 27 -3.175,6.416; 28 -4.445,6.416; 29 -5.715,6.416; 30 -6.985,6.416; 31 -8.255,6.416; 32 -9.525,6.416
TQFP48 = smd 1.016 x 0.305: 1 -4.191,2.794; 2 -4.191,2.286; 3 -4.191,1.778; 4 -4.191,1.27; 5 -4.191,0.762; 6 -4.191,0.254; 7 -4.191,-0.254; 8 -4.191,-0.762; 9 -4.191,-1.27; 10 -4.191,-1.778; 11 -4.191,-2.286; 12 -4.191,-2.794; 25 4.191,-2.794; 26 4.191,-2.286; 27 4.191,-1.778; 28 4.191,-1.27; 29 4.191,-0.762; 30 4.191,-0.254; 31 4.191,0.254; 32 4.191,0.762; 33 4.191,1.27; 34 4.191,1.778; 35 4.191,2.286; 36 4.191,2.794 | smd 0.305 x 1.016: 13 -2.794,-4.191; 14 -2.286,-4.191; 15 -1.778,-4.191; 16 -1.27,-4.191; 17 -0.762,-4.191; 18 -0.254,-4.191; 19 0.254,-4.191; 20 0.762,-4.191; 21 1.27,-4.191; 22 1.778,-4.191; 23 2.286,-4.191; 24 2.794,-4.191; 37 2.794,4.191; 38 2.286,4.191; 39 1.778,4.191; 40 1.27,4.191; 41 0.762,4.191; 42 0.254,4.191; 43 -0.254,4.191; 44 -0.762,4.191; 45 -1.27,4.191; 46 -1.778,4.191; 47 -2.286,4.191; 48 -2.794,4.191
SO14 = smd 0.66 x 2.032: 1 -3.81,-3.073; 2 -2.54,-3.073; 3 -1.27,-3.073; 4 0,-3.073; 5 1.27,-3.073; 6 2.54,-3.073; 7 3.81,-3.073; 8 3.81,3.073; 9 2.54,3.073; 10 1.27,3.073; 11 0,3.073; 12 -1.27,3.073; 13 -2.54,3.073; 14 -3.81,3.073
DIL16 = drill 0.813 long: 1 -8.89,-3.81; 2 -6.35,-3.81; 3 -3.81,-3.81; 4 -1.27,-3.81; 5 1.27,-3.81; 6 3.81,-3.81; 7 6.35,-3.81; 8 8.89,-3.81; 9 8.89,3.81; 10 6.35,3.81; 11 3.81,3.81; 12 1.27,3.81; 13 -1.27,3.81; 14 -3.81,3.81; 15 -6.35,3.81; 16 -8.89,3.81
LED3MM = drill 0.813 octagon: A -1.27,0; K 1.27,0
DIL08 = drill 0.813 offset: 1 -3.81,-3.81; 2 -1.27,-3.81; 3 1.27,-3.81; 4 3.81,-3.81; 5 3.81,3.81; 6 1.27,3.81; 7 -1.27,3.81; 8 -3.81,3.81
HC49UP = smd 5.334 x 1.93: 1 -4.826,0; 2 4.826,0
R0402 = smd 0.7 x 0.9: 1 -0.65,0; 2 0.65,0
B3F-31XX = drill 1.016 octagon: 1 -2.261,-1.245; 2 2.261,-1.245 | drill 1.499 pad 2.159: 3 -3.505,1.245; 4 3.505,1.245
TL3XWO = drill 1.1 pad 1.422 long: 1 -2.54,-5.08; 2 0,-5.08; 3 2.54,-5.08 | drill 1.1 pad 1.676: M1 -2.54,0; M2 2.54,0
B3F-10XX = drill 1.016 long: 1 -3.251,2.261; 2 3.251,2.261; 3 -3.251,-2.261; 4 3.251,-2.261
DIP08SB = drill 0.813 long: 1 -8.89,-3.81; 2 -6.35,-3.81; 3 -3.81,-3.81; 4 -1.27,-3.81; 5 1.27,-3.81; 6 3.81,-3.81; 7 6.35,-3.81; 8 8.89,-3.81; 9 8.89,3.81; 10 6.35,3.81; 11 3.81,3.81; 12 1.27,3.81; 13 -1.27,3.81; 14 -3.81,3.81; 15 -6.35,3.81; 16 -8.89,3.81
DPACK = smd 1.6 x 3: 1 -2.28,-4.8; 3 2.28,-4.8 | smd 5.8 x 6.2: 4 0,2.38
MAB5SH = drill 1.321 octagon: 1 7.62,5.08; 3 -7.62,5.08; 4 5.08,7.62; 5 -5.08,7.62; PE -2.54,-5.08; PE@ 2.54,-5.08 | drill 1.321 long: 2 0,5.08 | hole 2.794: 7.62,0; -7.62,0
MA156-22-2 = smd 2.286 x 8.255: 1 41.605,-0.381; 2 37.643,-0.381; 3 33.68,-0.381; 4 29.718,-0.381; 5 25.756,-0.381; 6 21.793,-0.381; 7 17.831,-0.381; 8 13.868,-0.381; 9 9.906,-0.381; 10 5.944,-0.381; 11 1.981,-0.381; 12 -1.981,-0.381; 13 -5.944,-0.381; 14 -9.906,-0.381; 15 -13.868,-0.381; 16 -17.831,-0.381; 17 -21.793,-0.381; 18 -25.756,-0.381; 19 -29.718,-0.381; 20 -33.68,-0.381; 21 -37.643,-0.381; 22 -41.605,-0.381 | smd 2.286 x 8.255 bottom: A 41.605,-0.381; B 37.643,-0.381; C 33.68,-0.381; D 29.718,-0.381; E 25.756,-0.381; F 21.793,-0.381; H 17.831,-0.381; J 13.868,-0.381; K 9.906,-0.381; L 5.944,-0.381; M 1.981,-0.381; N -1.981,-0.381; P -5.944,-0.381; R -9.906,-0.381; S -13.868,-0.381; T -17.831,-0.381; U -21.793,-0.381; V -25.756,-0.381; W -29.718,-0.381; X -33.68,-0.381; Y -37.643,-0.381; Z -41.605,-0.381
M09HP = drill 1.016 octagon: 1 -5.486,1.27; 2 -2.743,1.27; 3 0,1.27; 4 2.743,1.27; 5 5.486,1.27; 6 -4.115,-1.27; 7 -1.372,-1.27; 8 1.372,-1.27; 9 4.115,-1.27 | drill 3.302 pad 5.08: G1 -12.522,0; G2 12.522,0

### Placement (x,y rotation side)
3V3  80.65,30.16 0 bottom
512K  119.38,34.61 0 top
B0  59.69,38.1 270 top
B1  57.15,38.1 270 top
B2  54.61,38.1 270 top
B3  52.07,38.1 270 top
B4  49.53,38.1 270 top
B5  46.99,38.1 270 top
B6  44.45,38.1 270 top
C1  76.84,53.66 0 top
C2  56.52,53.66 180 top
C3  13.34,32.7 270 top
C4  13.34,27.62 270 top
C5  13.34,37.78 90 top
C6  13.34,22.54 90 top
C7  13.34,54.29 270 top
C8  13.34,49.21 270 top
C9  13.34,59.37 90 top
C10  13.34,44.13 90 top
C11  29.53,32.07 0 top
C12  35.88,32.07 0 top
C13  29.85,55.25 270 top
C14  43.18,55.25 270 top
C15  69.53,47.31 0 top
C16  67.95,35.56 270 top
C17  26.67,14.29 180 top
C18  105.09,53.98 180 top
C19  112.4,34.61 180 top
C20  87,20 0 top
C21  67.63,18.1 180 top
D1  33.66,42.86 0 top
GND  80.65,27.62 0 bottom
IC1  76.84,26.35 0 top
IC2  114.3,47.62 0 top
IC4  114.94,23.18 270 top
IC5  77.47,47.31 270 top
IC7  49.53,51.75 0 top
IC11  20.96,49.21 270 top
IC12  20.96,27.62 270 top
IO_SEL  41.91,38.1 270 top
LED1  13.65,68.58 0 top
LED2  13.65,64.14 0 top
LED3  115.57,68.58 0 top
OK1  36.2,51.75 0 top
Q1  66.68,53.66 180 top
R1  70.8,60.64 180 top
R2  79.69,58.1 0 top
R3  62.87,49.85 0 top
R4  46.36,58.1 180 top
R5  50.17,60.64 0 top
R6  66.68,49.85 180 top
R7  29.85,51.75 270 top
R8  91.44,60.64 180 top
R9  100.33,58.42 0 top
R10  30.8,59.69 270 top
R11  30.16,14.29 180 top
R12  17.46,61.28 270 top
R13  34.29,59.69 270 top
R14  37.78,59.69 270 top
R15  20.32,61.28 90 top
R16  14.61,61.28 90 top
R17  46.99,42.23 270 top
R18  49.53,42.23 270 top
R19  52.07,42.23 270 top
R20  54.61,42.23 270 top
R21  57.15,42.23 270 top
R22  59.69,42.23 270 top
R23  11.75,61.28 270 top
R24  44.45,42.23 270 top
R25  41.91,42.23 270 top
R26  108.59,59.05 0 top
R27  108.59,60.96 0 top
R28  112.08,67.94 90 top
RESET  126.37,67.63 180 top
S1  3.81,48.58 90 top
S2  3.81,57.47 90 top
S3  3.81,66.36 90 top
S4  115.57,61.28 0 top
S5  126.05,61.28 0 top
S6  50.8,35.88 180 top
TCK  80.65,25.08 0 bottom
TDI  80.65,20 0 bottom
TDO  80.65,32.7 0 bottom
TMS  80.65,22.54 0 bottom
VR1  33.02,36.51 270 top
X1  59.06,68.26 180 top
X2  79.69,68.26 180 top
X3  100.33,68.26 180 top
X4  66.04,5.08 0 top
X5  32.39,66.67 180 top

### Tracks (layer width: path | path; a pad name or v marks a point on that pad's centre or on a via)
!BLK1  (via drill 0.3)
  Top 0.152: X4.10 71.98,11.02 v72.07,11.11 77.34,16.38 IC1.39
!BLK2  (via drill 0.3)
  Top 0.152: X4.11 68.02,10.87 v68.26,11.11 69.85,12.7 72.39,12.7 75.84,16.15 IC1.36
!BLK3  (via drill 0.3)
  Top 0.152: X4.12 64.06,10.72 v64.45,11.11 66.68,13.34 71.12,13.34 74.84,17.05 IC1.34
!BLK5  (via drill 0.3)
  Top 0.152: X4.13 60.1,10.88 v60.33,11.11 63.18,13.97 71.12,13.97 74.34,17.18 IC1.33
!FCE
  Top 0.152: IC2.22 121.28,43.82 121.92,43.18 121.92,40.32 120.65,39.05 86.04,39.05 82.34,35.35 IC1.77
!IO2  (via drill 0.3)
  Top 0.152: IC1.28 71.84,17.22 71.12,16.51 53.66,16.51 v48.26,11.11
  Bottom 0.152: X4.T 48.21,11.06 v48.26,11.11
!IO3  (via drill 0.3)
  Top 0.152: v43.82,11.11 51.44,18.73 64.77,18.73 66.39,20.35 IC1.25
  Bottom 0.152: v43.82,11.11 44.25,10.68 X4.U
!IRQ  (via drill 0.3)
  Top 0.152: X4.19 36.32,9.97 v37.47,11.11 | IC1.20 68.83,22.86 64.45,22.86 v64.14,22.54
  Bottom 0.152: v37.47,11.11 48.9,22.54 v64.14,22.54
!NMI  (via drill 0.3)
  Top 0.152: IC1.19 48.44,23.35 v36.32,11.24
  Bottom 0.152: v36.32,11.24 X4.W
!OE  (via drill 0.3)
  Top 0.152: IC2.24 118.43,46.36 v118.11,46.04 | IC4.24 v118.11,22.54 110.49,22.54 109.86,21.91 89.77,21.91 89.22,21.35 IC1.53
  Bottom 0.152: v118.11,22.54 v118.11,46.04
!OUT1  (via drill 0.3)
  Top 0.152: v79.06,41.91 79.25,42.1 IC5.34 | IC1.90 75.84,38.69 v75.88,38.73
  Bottom 0.152: v75.88,38.73 v79.06,41.91
!RAM1
  Top 0.152: X4.14 56.13,9.78 60.96,14.6 71.12,14.6 73.84,17.32 IC1.32
!RAM2
  Top 0.152: X4.15 52.17,9.94 57.47,15.24 71.12,15.24 72.84,16.95 IC1.30
!RAM3
  Top 0.152: X4.16 48.21,9.79 54.29,15.87 71.12,15.87 72.34,17.09 IC1.29
!RCE
  Top 0.152: IC1.46 80.84,17.27 81.6,16.51 87,16.51 89.85,19.37 109.86,19.37 110.49,20 IC4.22
!RESET  (via drill 0.3)
  Top 0.152: IC1.99 71.34,35.35 71.12,35.56 v69.53,35.56 | v32.36,11.09 32.36,12.94 31.01,14.29 R11.1
  Bottom 0.152: v69.53,35.56 83.82,35.56 88.27,40.01 88.27,53.02 90.17,54.93 121.92,54.93 125.09,58.1 125.09,67.88 RESET.2 124.08,68.9 | X4.X v32.36,11.09 45.72,24.45 58.42,24.45 v69.53,35.56 | v69.53,35.56 70.49,35.56
!UART_OE
  Top 0.152: IC1.92 74.84,40.1 72.07,42.86 72.07,46.67 72.45,47.05 IC5.19
!UART_WE
  Top 0.152: IC5.16 72.71,48.58 71.12,46.99 71.12,42.86 74.34,39.65 IC1.93
!WE  (via drill 0.3)
  Top 0.152: IC4.29 v116.84,28.89 110.49,28.89 109.86,28.26 89.54,28.26 86.63,25.35 IC1.61 | v116.84,52.71 IC2.31
  Bottom 0.152: v116.84,28.89 v116.84,52.71
ADDR0  (via drill 0.3)
  Top 0.152: v106.36,43.82 IC2.12 | IC5.28 76.2,41.59 76.84,40.96 v106.36,40.96 | IC4.12 v106.36,18.73 89.85,18.73 87,15.87 80.65,15.87 79.34,17.18 IC1.43
  Bottom 0.152: X4.B 103.68,10.02 105.09,11.43 105.73,11.43 106.36,12.07 v106.36,18.73 v106.36,40.96 v106.36,43.82
ADDR1  (via drill 0.3)
  Top 0.152: v104.46,45.08 IC2.11 | IC5.27 75.69,41.47 76.84,40.32 v104.46,40.32 | IC4.11 v104.46,20 89.85,20 87,17.15 82.55,17.15 82.34,17.36 IC1.49
  Bottom 0.152: X4.C 99.72,9.87 102.55,12.7 103.82,12.7 104.46,13.34 v104.46,20 v104.46,40.32 v104.46,45.08
ADDR2  (via drill 0.3)
  Top 0.152: v102.55,46.36 IC2.10 | IC5.26 75.18,41.34 76.84,39.69 v102.55,39.69 | IC4.23 110.49,21.27 109.86,20.64 v102.55,20.64 89.85,20.64 87.31,18.1 83.09,18.1 IC1.50
  Bottom 0.152: X4.D 95.76,10.03 99.7,13.97 101.92,13.97 102.55,14.6 v102.55,20.64 v102.55,39.69 v102.55,46.36
ADDR3  (via drill 0.3)
  Top 0.152: v100.65,47.62 IC2.9 | IC4.10 v100.65,21.27 89.85,21.27 89.43,20.85 IC1.52
  Bottom 0.152: X4.E 91.8,9.88 97.16,15.24 100.01,15.24 100.65,15.87 v100.65,21.27 v100.65,47.62
ADDR4  (via drill 0.3)
  Top 0.152: v98.74,48.9 IC2.8 | IC4.9 v98.74,22.54 89.85,22.54 89.16,21.85 IC1.54
  Bottom 0.152: X4.F 87.83,10.05 94.3,16.51 98.11,16.51 98.74,17.15 v98.74,22.54 v98.74,48.9
ADDR5  (via drill 0.3)
  Top 0.152: v96.84,50.16 IC2.7 | IC4.25 110.49,23.81 109.86,23.18 v96.84,23.18 89.85,23.18 89.03,22.35 IC1.55
  Bottom 0.152: X4.H 83.87,9.89 91.76,17.78 96.2,17.78 96.84,18.42 v96.84,23.18 v96.84,50.16
ADDR6  (via drill 0.3)
  Top 0.152: v94.93,51.43 IC2.6 | IC4.8 v94.93,23.81 89.85,23.81 88.89,22.85 IC1.56
  Bottom 0.152: X4.J 79.91,10.06 88.9,19.05 94.3,19.05 94.93,19.68 v94.93,23.81 v94.93,51.43
ADDR7  (via drill 0.3)
  Top 0.152: v93.03,52.71 IC2.5 | IC4.26 110.49,25.08 109.86,24.45 v93.03,24.45 | IC1.41 78.34,12.3 v77.15,11.11
  Bottom 0.152: X4.K 75.95,9.91 v77.15,11.11 79.06,11.11 88.27,20.32 92.39,20.32 93.03,20.95 v93.03,24.45 v93.03,52.71
ADDR8  (via drill 0.3)
  Top 0.152: IC2.27 122.56,50.16 124.46,48.26 124.46,37.78 123.19,36.51 v91.12,36.51 | v91.12,24.45 91.76,25.08 IC4.7 | IC1.37 76.34,16.69 v76.52,16.51
  Bottom 0.152: X4.L 71.98,9.75 76.52,14.29 | v91.12,36.51 v91.12,24.45 91.12,22.22 90.49,21.59 83.82,21.59 76.52,14.29 | 76.52,14.29 v76.52,16.51
ADDR9  (via drill 0.3)
  Top 0.152: IC2.26 121.28,48.9 123.19,46.99 123.19,39.05 121.92,37.78 v90.17,37.78 | IC4.27 110.49,26.35 109.86,25.72 91.44,25.72 v90.17,24.45 | IC1.35 75.34,16.6 v75.25,16.51
  Bottom 0.152: X4.M 68.02,9.92 74.61,16.51 | 74.61,16.51 79.69,21.59 80.96,21.59 81.6,22.22 89.54,22.22 90.17,22.86 v90.17,24.45 v90.17,37.78 | 74.61,16.51 v75.25,16.51
ADDR10  (via drill 0.3)
  Top 0.152: IC2.23 117.48,45.08 110.49,52.07 v89.22,52.07 | IC4.6 91.12,26.35 v89.22,24.45 88.9,24.45 88.31,23.85 IC1.58
  Bottom 0.152: X4.N 64.06,9.77 77.79,23.49 88.58,23.49 89.22,24.13 v89.22,24.45 v89.22,52.07
ADDR11  (via drill 0.3)
  Top 0.152: IC2.25 121.28,47.62 122.56,46.36 122.56,39.69 121.28,38.42 v88.27,38.42 | IC4.28 110.49,27.62 109.86,26.99 90.17,26.99 v87.63,24.45 | IC1.59 83.6,24.35 v83.5,24.45
  Bottom 0.152: X4.P 60.1,9.93 68.26,18.1 70.49,18.1 76.84,24.45 v83.5,24.45 v87.63,24.45 88.27,25.08 v88.27,38.42
ADDR12  (via drill 0.3)
  Top 0.152: IC2.4 110.49,55.88 112.4,57.79 122.56,57.79 128.27,52.07 128.27,33.34 123.19,28.26 110.49,28.26 109.86,27.62 IC4.5 89.85,27.62 v87.63,25.4 87.08,24.85 IC1.60
  Bottom 0.152: X4.R 56.13,9.78 72.39,26.04 87,26.04 v87.63,25.4
ADDR13  (via drill 0.3)
  Top 0.152: v63.18,19.68 64.77,19.68 65.94,20.85 IC1.24
  Bottom 0.152: X4.S 52.17,9.94 61.91,19.68 v63.18,19.68
BADDR13
  Top 0.152: IC2.28 123.83,51.43 125.73,49.53 125.73,34.61 123.19,32.07 110.49,32.07 109.86,31.43 IC4.2 90.17,31.43 86.59,27.85 IC1.66
BADDR14
  Top 0.152: IC2.29 123.83,52.71 126.37,50.16 126.37,34.61 123.19,31.43 IC4.31 110.49,31.43 109.86,30.8 90.17,30.8 86.73,27.35 IC1.65
BADDR15
  Top 0.152: IC2.3 111.76,55.88 113.03,57.15 121.92,57.15 127.64,51.43 127.64,33.97 123.19,29.53 110.49,29.53 109.86,28.89 IC4.4 89.54,28.89 87,26.35 IC1.63
BADDR16
  Top 0.152: IC2.2 113.03,55.88 113.67,56.51 121.28,56.51 127,50.8 127,34.61 123.19,30.8 110.49,30.8 109.86,30.16 IC4.3 90.17,30.16 86.86,26.85 IC1.64
BADDR17
  Top 0.152: IC2.30 118.11,51.12 118.43,50.8 123.19,50.8 125.09,48.9 125.09,37.15 123.83,35.88 116.59,35.88 | IC1.74 86.15,31.85 90.17,35.88 116.59,35.88 | 116.59,35.88 512K.1
BADDR18  (via drill 0.3)
  Top 0.152: IC2.1 114.3,51.43 116.21,49.53 121.92,49.53 123.83,47.62 123.83,38.42 122.56,37.15 v108.59,37.15 90.81,37.15 88.01,34.35 IC1.76 | IC4.1 108.59,32.77 v108.59,33.97
  Bottom 0.152: v108.59,37.15 v108.59,33.97
CR/!W  (via drill 0.3)
  Top 0.152: IC1.23 64.85,21.35 v64.14,20.64 | X4.18 40.28,9.8 v41.59,11.11
  Bottom 0.152: v41.59,11.11 51.12,20.64 v64.14,20.64
CTS  (via drill 0.3)
  Top 0.152: IC5.38 79.63,45.02 79.38,44.77 78.74,44.77 78.11,45.4 76.52,45.4 v75.88,44.77
  Bottom 0.152: v75.88,44.77 75.25,44.13 42.55,44.13 38.74,40.32 IC11.9
DATA0  (via drill 0.3)
  Top 0.152: X4.2 103.68,10.97 v103.82,11.11 105.73,13.02 109.86,13.02 110.49,13.65 IC4.17 | IC5.43 82.93,47.56 87.95,42.54 v105.41,42.54 IC2.13 | v105.41,32.07 90.17,32.07 86.46,28.35 IC1.67
  Bottom 0.152: v103.82,11.11 105.41,12.7 v105.41,32.07 v105.41,42.54
DATA1  (via drill 0.3)
  Top 0.152: X4.3 99.72,11.09 v99.7,11.11 102.87,14.29 109.86,14.29 110.49,14.92 IC4.18 | IC2.14 110.49,42.54 109.86,43.18 v103.51,43.18 87.95,43.18 83.06,48.07 IC5.44 | IC1.68 86.32,28.85 90.17,32.7 v103.51,32.7
  Bottom 0.152: v99.7,11.11 101.92,13.34 102.87,13.34 103.51,13.97 v103.51,32.7 v103.51,43.18
DATA2  (via drill 0.3)
  Top 0.152: X4.4 95.76,10.99 v95.89,11.11 99.7,14.92 IC4.15 | IC2.15 111.76,42.86 110.17,44.45 v101.6,44.45 87.31,44.45 83.19,48.58 IC5.45 | IC1.70 86.69,29.85 90.17,33.34 v101.6,33.34
  Bottom 0.152: v95.89,11.11 99.38,14.6 100.97,14.6 101.6,15.24 v101.6,33.34 v101.6,44.45
DATA3  (via drill 0.3)
  Top 0.152: X4.5 91.8,10.83 v92.08,11.11 96.52,15.56 109.86,15.56 110.49,16.19 IC4.19 | IC2.17 114.3,41.91 110.49,45.72 v99.7,45.72 86.68,45.72 83.31,49.09 IC5.46 | IC1.71 86.55,30.35 90.17,33.97 v99.7,33.97
  Bottom 0.152: v92.08,11.11 96.84,15.87 99.06,15.87 99.7,16.51 v99.7,33.97 v99.7,45.72
DATA4  (via drill 0.3)
  Top 0.152: X4.6 87.83,11 v87.95,11.11 93.03,16.19 IC4.14 | IC2.18 115.57,41.91 110.49,46.99 v97.79,46.99 86.04,46.99 83.44,49.59 IC5.47 | IC1.72 86.42,30.85 90.17,34.61 v97.79,34.61
  Bottom 0.152: v87.95,11.11 93.98,17.15 97.16,17.15 97.79,17.78 v97.79,34.61 v97.79,46.99
DATA5  (via drill 0.3)
  Top 0.152: X4.7 83.87,10.85 v84.14,11.11 89.85,16.83 109.86,16.83 110.49,17.46 IC4.20 | IC5.2 79.76,52.13 80.01,52.39 81.28,52.39 85.41,48.26 v95.89,48.26 110.49,48.26 116.84,41.91 IC2.19 | IC1.73 86.28,31.35 90.17,35.24 v95.89,35.24
  Bottom 0.152: v84.14,11.11 91.44,18.42 95.25,18.42 95.89,19.05 v95.89,35.24 v95.89,48.26
DATA6  (via drill 0.3)
  Top 0.152: X4.8 79.91,11.01 v80.01,11.11 | IC5.3 79.25,52.26 80.01,53.02 81.28,53.02 84.77,49.53 v93.98,49.53 110.49,49.53 118.11,41.91 IC2.20 | IC1.42 78.84,12.29 v80.01,11.11 | v80.01,11.11 81.28,12.38 84.77,12.38 89.85,17.46 IC4.13
  Bottom 0.152: v80.01,11.11 88.58,19.68 93.34,19.68 93.98,20.32 v93.98,49.53
DATA7  (via drill 0.3)
  Top 0.152: X4.9 75.95,10.86 v76.2,11.11 77.84,12.75 IC1.40 | IC5.4 78.74,52.39 80.01,53.66 81.28,53.66 84.14,50.8 v92.08,50.8 110.49,50.8 118.75,42.54 IC2.21 | IC4.21 110.49,18.73 109.86,18.1 89.85,18.1 87,15.24 v80.33,15.24
  Bottom 0.152: v92.08,50.8 92.08,21.59 91.44,20.95 87.95,20.95 82.23,15.24 v80.33,15.24 v76.2,11.11
DCD  (via drill 0.3)
  Top 0.152: v75.88,46.04 IC5.40 | IC12.12 24.13,26.35 22.23,28.26 22.23,40.32 23.5,41.59 26.04,41.59 28.58,44.13 v40.01,44.13
  Bottom 0.152: v40.01,44.13 41.91,46.04 v75.88,46.04
DSR  (via drill 0.3)
  Top 0.152: IC5.39 79.19,45.53 v79.06,45.4
  Bottom 0.152: v79.06,45.4 77.15,43.5 43.18,43.5 27.62,27.94 27.62,20.32 26.04,18.73 IC12.9
DTR  (via drill 0.3)
  Top 0.152: IC5.33 78.74,44.13 78.11,44.77 v77.15,44.77 | IC11.11 v42.55,45.4
  Bottom 0.152: v42.55,45.4 76.52,45.4 v77.15,44.77
EIA_CTS
  Top 0.152: R10.1 31.01,60.56 X5.8
  Bottom 0.152: IC11.8 18.42,40.32 20,41.91 20,56.51 28.27,64.78 28.26,64.8 28.26,66.04 30.16,67.94 X5.8
EIA_DCD
  Top 0.152: X5.1 37.87,60.43 R14.1
  Bottom 0.152: IC12.13 23.5,28.89 22.86,29.53 22.86,46.04 23.5,46.67 27.94,46.67 36.2,54.93 36.2,57.47 37.87,59.14 X5.1
EIA_DSR
  Top 0.152: X5.6 36.5,62.55 R13.1
  Bottom 0.152: X5.6 36.5,60.63 33.66,57.79 33.66,54.93 27.94,49.21 23.5,49.21 21.91,47.62 21.91,22.22 18.42,18.73 IC12.8
EIA_DTR
  Bottom 0.152: IC11.14 26.04,53.02 29.21,56.2 29.21,64.97 X5.4
EIA_RTS
  Bottom 0.152: IC11.7 18.42,42.86 19.05,43.5 19.05,57.79 25.4,64.14 25.4,67.31 27.62,69.53 32.17,69.53 X5.7
EIA_RXD
  Bottom 0.152: IC11.13 26.04,50.48 31.12,55.56 31.12,61.39 X5.2
EIA_TXD
  Bottom 0.152: X5.3 30.16,63.18 30.16,55.88 26.04,51.75 23.5,51.75 20.96,49.21 20.96,23.81 18.42,21.27 IC12.7
GND  (via drill 0.3, 1.1)
  Top 0.152: IC1.44 79.84,17.32 80.01,17.15
  Top 1.778: X4.Z 24.45,5.02
  Top 1.93: X4.A v107.65,11.11 | v24.44,11.11 X4.Z
  Bottom 1.93: v107.65,11.11 X4.A | v24.44,11.11 X4.Z
  other vias: 113.03,42.23 84.14,33.66 69.53,33.66 69.53,19.05 84.14,19.05 71.76,20.64 83.19,20 83.19,32.7 70.49,32.7 71.12,47.94 74.61,47.94 80.65,27.62 103.19,53.98 78.11,32.7 54.29,48.58 44.77,54.93 44.77,48.58 54.29,54.93 111.44,14.29 111.44,33.34 70.49,27.62 83.19,27.62 67.31,26.35 40.01,24.13
  pour Top (isolate 0.178): 20.96,75.88 20.96,70.8 0,70.8 0,11.43 20.64,11.43 20.64,9.84 111.44,9.84 111.44,11.43 132.08,11.43 132.08,70.8 111.12,70.8 111.12,75.88
  pour Bottom (isolate 0.178): 0,11.43 20.64,11.43 20.64,9.84 111.44,9.84 111.44,11.43 132.08,11.43 132.08,70.8 111.12,70.8 111.12,75.88 20.96,75.88 20.96,70.8 0,70.8
IO_SEL  (via drill 0.3)
  Top 0.152: R25.2 41.58,41.58 40.64,40.64 40.64,38.1 41.28,37.47 41.78,37.47 IO_SEL.2 S6.9 | IC1.16 42,24.85 v40.01,22.86
  Bottom 0.152: S1.2 10.16,48.58 11.43,47.31 11.43,18.73 13.97,16.19 33.34,16.19 v40.01,22.86 43.18,26.04 43.18,30.8 S6.9
MEM_EN  (via drill 0.3)
  Top 0.152: S2.2 7.62,57.47 6.35,58.74 6.35,60.64 7.64,61.93 R23.1 | IC1.17 42.77,24.35 v40.01,21.59
  Bottom 0.152: S2.2 6.35,54.93 6.35,21.27 12.7,14.92 33.34,14.92 v40.01,21.59
MIDI_RXD
  Top 0.152: 43.82,53.02 39.37,53.02 37.47,54.93 OK1.6 | 43.82,53.02 46.36,53.02 46.99,53.66 IC7.13 R4.1 | 43.82,53.02 43.82,47.94 45.72,46.04 66.04,46.04 73.34,38.74 IC1.95
MIDI_TXD
  Top 0.152: IC1.94 73.84,39.19 66.04,46.99 51.44,46.99 50.8,47.62 IC7.5
N$1
  Top 0.152: X3.5 103.19,58.42 R9.2
N$2
  Top 0.152: IC7.6 IC7.9
N$3
  Top 0.152: R8.1 X3.4
N$4
  Top 0.152: R9.1 87.31,58.42 85.73,56.83 53.98,56.83 53.34,56.2 IC7.8
N$5
  Top 0.152: R15.2 20.32,62.55 19.69,63.18 17.78,63.18 LED1.A
N$6  (via drill 0.3)
  Top 0.152: v47.31,60.64 R5.1
  Bottom 0.152: D1.C 31.43,42.86 34.93,46.36 OK1.2 34.93,48.26 v47.31,60.64
N$7
  Top 0.152: R5.2 X1.4
N$8
  Bottom 0.152: X1.5 54.61,51.12 40.01,51.12 37.47,48.58 OK1.3 D1.A
N$9
  Top 0.152: OK1.7 34.93,54.93 32.4,52.4 R7.1
N$10
  Top 0.152: R2.2 82.23,58.1 X2.5
N$11
  Top 0.152: IC7.10 50.8,56.2 52.71,58.1 R2.1
N$12
  Top 0.152: IC7.12 IC7.11
N$13
  Top 0.152: R1.1 X2.4
N$14  (via drill 0.3)
  Top 0.152: IC1.78 81.84,36.11 v83.5,37.78 | S5.4 S5.3 120.85,60.96 R27.2
  Bottom 0.152: v83.5,37.78 87.31,41.59 87.31,53.34 89.85,55.88 119.66,55.88 S5.3
N$15
  Top 0.152: IC5.15 72.58,49.09 72.07,48.58 62.55,48.58 62.22,48.91 R3.1
N$16
  Top 0.152: C1.1 Q1.1 71.14,53.66 R6.1 67.33,49.59 IC5.14
N$17
  Top 0.152: C2.1 Q1.2 62.22,53.66 R6.2 R3.2
N$18  (via drill 0.3)
  Top 0.152: IC1.81 80.34,37.47 v80.65,37.78
  Bottom 0.152: LED1.K 14.92,66.68 18.42,63.18 21.59,63.18 23.5,65.09 23.5,68.9 26.67,72.07 75.57,72.07 83.19,64.45 83.19,40.32 v80.65,37.78
N$19
  Top 0.152: IC5.12 74.68,52.13 74.93,52.39 78.11,52.39 78.23,52.26 IC5.5
N$20  (via drill 0.3)
  Top 0.152: S4.4 S4.3 112.28,59.05 R26.2 | IC1.80 80.84,37.02 v81.6,37.78
  Bottom 0.152: S4.3 111.09,57.79 89.22,57.79 85.41,53.97 85.41,41.59 v81.6,37.78
N$21  (via drill 0.3)
  Top 0.152: IC1.82 79.84,37.64 v79.69,37.78
  Bottom 0.152: LED2.K 16.83,62.23 21.91,62.23 24.45,64.77 24.45,68.26 27.31,71.12 75.25,71.12 82.55,63.82 82.55,40.64 v79.69,37.78
N$22
  Top 0.152: LED3.A 112.09,68.58 R28.2
N$23  (via drill 0.3)
  Top 0.152: IC1.79 81.34,36.57 v82.55,37.78
  Bottom 0.152: LED3.K 116.84,60.64 113.03,56.83 89.54,56.83 86.36,53.66 86.36,41.59 v82.55,37.78
N$24
  Top 0.152: 44.45,37.78 44.45,38.42
N$25
  Top 0.152: LED2.A 13.65,62.86 13.67,62.86 R16.2
N$26
  Top 0.152: 46.99,37.78 46.99,38.42
N$27  (via drill 0.3)
  Top 0.152: IC1.48 81.84,22.62 80.65,23.81 TCK.TP
  other vias: 80.65,25.08
N$28
  Top 0.152: 49.53,37.78 49.53,38.42
N$29
  Top 0.152: 52.07,37.78 52.07,38.42
N$30
  Top 0.152: 54.61,37.78 54.61,38.42
N$31  (via drill 0.3)
  Top 0.152: IC1.47 81.34,21.85 TMS.TP
  other vias: 80.65,22.54
N$32  (via drill 0.3)
  Top 0.152: IC1.45 80.34,19.69 TDI.TP
  other vias: 80.65,20
N$33  (via drill 0.3)
  Top 0.152: IC1.83 79.34,33.38 80.01,32.7 TDO.TP
  other vias: 80.65,32.7
N$34
  Top 0.152: 57.15,37.78 57.15,38.42
N$35
  Top 0.152: 59.69,37.78 59.69,38.42
N$36
  Top 0.406: IC12.1 16.13,36.51 C3.+
N$37
  Top 0.406: IC12.3 13.59,31.43 C3.-
N$38
  Top 0.406: IC12.4 13.59,28.89 C4.+
N$39
  Top 0.406: IC12.5 13.59,26.35 C4.-
N$40
  Bottom 0.406: IC12.2 16.13,33.97 C5.+
N$41
  Top 0.406: IC12.6 13.59,23.81 C6.-
N$42
  Top 0.406: IC11.1 16.13,58.1 C7.+
N$43
  Top 0.406: IC11.3 13.59,53.02 C7.-
N$44
  Top 0.305: 13.67,50.48 13.59,50.48
  Top 0.406: IC11.4 13.67,50.48 | 13.59,50.48 C8.+
N$45
  Top 0.406: C8.- 13.59,47.94 IC11.5
N$46
  Bottom 0.406: IC11.2 16.13,55.56 C9.+
N$47
  Top 0.406: IC11.6 13.59,45.4 C10.-
N$48  (via drill 0.3)
  Top 0.152: IC4.30 v119.38,30.16
  Bottom 0.152: v119.38,30.16 512K.2
  other vias: 119.38,34.61
N$49
  Top 0.152: 119.7,34.61 120.65,34.61
PE  (3 unrouted)
PHI2  (via drill 0.3)
  Top 0.152: IC1.22 63.45,21.85 v63.18,21.59
  Bottom 0.152: X4.V 40.28,11.71 50.17,21.59 v63.18,21.59
REG_BASE0
  Top 0.152: R22.2 59.36,41.58 58.42,40.64 58.42,38.1 59.06,37.47 59.56,37.47 B0.2 S6.16 59.98,32.35 IC1.1
REG_BASE1
  Top 0.152: B1.2 56.95,37.54 | R21.2 56.82,41.58 55.88,40.64 55.88,38.1 56.52,37.47 57.02,37.47 B1.2 | B1.2 S6.15 59.06,30.16 60.33,30.16 62.02,31.85 IC1.2
REG_BASE2
  Top 0.152: R20.2 54.28,41.58 53.34,40.64 53.34,38.1 53.98,37.47 54.48,37.47 B2.2 S6.14 57.15,29.53 60.64,29.53 62.47,31.35 IC1.3
REG_BASE3
  Top 0.152: R19.2 51.74,41.58 50.8,40.64 50.8,38.1 51.44,37.47 51.94,37.47 B3.2 S6.13 52.07,31.75 54.93,28.89 60.96,28.89 62.92,30.85 IC1.4
REG_BASE4
  Top 0.152: R18.2 49.2,41.58 48.26,40.64 48.26,38.1 48.9,37.47 49.4,37.47 B4.2 S6.12 53.34,28.26 61.28,28.26 62.87,29.85 IC1.6
REG_BASE5
  Top 0.152: R17.2 46.66,41.58 45.72,40.64 45.72,38.1 46.36,37.47 46.86,37.47 B5.2 S6.11 51.44,27.62 61.91,27.62 63.64,29.35 IC1.7
REG_BASE6
  Top 0.152: R24.2 44.12,41.58 43.18,40.64 43.18,38.1 43.82,37.47 44.32,37.47 B6.2 S6.10 49.53,26.99 62.23,26.99 64.1,28.85 IC1.8
RS232_RXD
  Top 0.152: IC1.96 72.84,38.29 66.04,45.08 45.4,45.08 40.64,49.85 27.94,49.85 26.04,47.94 IC11.12
RS232_TXD
  Top 0.152: IC1.97 72.34,37.84 66.04,44.13 45.09,44.13 44.45,44.77 26.67,44.77 26.04,44.13 23.5,44.13 20.96,41.59 20.96,23.81 23.5,21.27 IC12.10
RTS  (via drill 0.3)
  Top 0.152: IC5.32 78.23,44.01 78.11,44.13 75.25,44.13 v74.61,44.77
  Bottom 0.152: v74.61,44.77 41.91,44.77 38.74,41.59 27.31,41.59 26.04,42.86 IC11.10
RXD  (via drill 0.3)
  Top 0.152: IC5.7 77.22,50.74 v78.42,49.53 | IC1.85 78.34,37.38 v78.74,37.78
  Bottom 0.152: v78.42,49.53 81.92,46.04 81.92,40.96 v78.74,37.78
TXD  (via drill 0.3)
  Top 0.152: IC5.8 76.71,50.29 v77.47,49.53 | IC1.86 77.84,37.83 v78.74,38.73
  Bottom 0.152: v77.47,49.53 81.28,45.72 81.28,41.28 v78.74,38.73
UART_CE  (via drill 0.3)
  Top 0.152: v76.52,49.53 76.2,49.85 IC5.9 IC5.10 | IC1.87 77.34,38.28 v77.79,38.73
  Bottom 0.152: v76.52,49.53 80.65,45.4 80.65,41.59 v77.79,38.73
UART_EN  (via drill 0.3)
  Top 0.152: S3.2 12.07,66.36 13.65,64.77 13.65,63.82 14.61,62.86 17.15,62.86 17.46,62.55 R12.1 | IC1.18 43.54,23.85 v40.01,20.32
  Bottom 0.152: v40.01,20.32 33.34,13.65 11.75,13.65 5.08,20.32 5.08,63.18 8.26,66.36 S3.2
UART_IRQ  (via drill 0.3)
  Top 0.152: IC5.30 77.22,41.97 v77.15,41.91 | IC1.91 75.34,39.46 v75.41,39.53
  Bottom 0.152: v75.41,39.53 75.41,40.16 75.57,40.32 v77.15,41.91
UART_RESET  (via drill 0.3)
  Top 0.152: IC5.35 79.76,42.16 v80.01,41.91 | IC1.89 76.34,38.23 v76.84,38.73
  Bottom 0.152: v76.84,38.73 v80.01,41.91
VCC  (via drill 0.3)
  Top 0.152: 97.16,71.44 97.16,68.58 93.34,64.77 91.76,64.77 90.79,63.8 R8.2 | 43.18,58.21 C14.1 | C17.1 28.4,14.29 R11.2 | 29.85,58.1 C13.1 | C9.- 13.35,60.4 14.61,60.4 R16.1 R12.2 R15.1 | 37.78,58.21 R14.2 | R10.2 30.8,58.42 30.48,58.1 | R23.2 12.4,60.63 12.7,60.33 | R28.1 112.08,66.99 110.17,65.09 103.82,65.09 103.66,64.93 | R26.1 107.62,59.37 107.31,59.37 | R27.1 107.62,61.28 107.31,61.28 | 512K.3 121.35,34.16 IC4.32 | 34.29,58.21 R13.2
  Top 0.305: 79.38,71.44 72.71,64.77 71.44,64.77 69.85,63.18 69.85,60.64 | 69.85,60.64 v69.85,59.05 | 69.85,60.64 R1.2 | v67.31,47.31 C15.1 | v77.15,47.05 IC5.42 | 28.4,36.51 28.4,34.41 VR1.3 | 28.4,32.07 C11.1
  Top 0.61: v115.57,52.71 IC2.32 | OK1.8 32.39,58.1 32.39,58.21 34.29,58.21 37.78,58.21 43.18,58.21 45.6,58.21 R4.2 IC7.14 | IC4.32 v115.57,32.7 115.57,34.61 C19.1 | v107.31,53.97 C18.1
  Top 0.813: 24.77,60.39 24.77,71.44 79.38,71.44 97.16,71.44 103.66,64.93 107.31,61.28 107.31,59.37 v107.31,53.97 | 24.77,60.39 IC11.16 29.85,58.1 30.48,58.1 32.39,58.1 | 28.4,16.83 28.4,32.07 28.4,36.51 IC12.16 | 28.4,16.83 28.4,14.29 X4.21 | 28.4,16.83 19.37,16.83 19.37,38.8 C5.- 11.75,38.8 11.75,60.33 12.7,60.33 13.34,60.33 C9.- 24.77,60.39
  Bottom 0.305: v67.31,47.31 67.31,47.05 69.85,47.05 | 69.85,47.05 v77.15,47.05 | v69.85,59.05 69.85,47.05
  Bottom 0.61: v115.57,52.71 v115.57,32.7
  Bottom 0.813: v107.31,53.97 108.59,52.71 v115.57,52.71
VDD  (via drill 0.3)
  Top 0.152: 48.9,42.86 48.58,42.86 48.58,42.88 R18.1
  Top 0.305: 83.19,23.35 IC1.57 | 76.84,23.35 IC1.38 | 76.84,23.35 70.84,23.35 IC1.26 70.84,18.1 C21.1 | 76.84,30.35 IC1.88 | 83.19,23.35 83.19,20.95 83.79,20.35 IC1.51 86,20.35 C20.1 | 67.95,36.51 65.41,36.51 61.28,40.64 61.28,42.88 R22.1 R21.1 R20.1 R19.1 R18.1 R17.1 R24.1 R25.1 41.29,42.88 35.56,37.15 35.56,36.67 VR1.4 35.4,32.24 C12.1 | 67.95,36.51 71.12,36.51 71.84,35.8 IC1.98 71.84,30.35 | 67.95,36.51 C16.1 | 76.84,30.35 80.46,30.35 3V3.TP 82.23,28.58 82.23,24.31 83.19,23.35 | 76.84,30.35 76.84,23.35 | 71.84,30.35 IC1.5 | 71.84,30.35 76.84,30.35
  other vias: 80.65,30.16
VR/!W
  Top 0.152: X4.17 44.25,10.27 51.12,17.15 71.12,17.15 71.34,17.36 IC1.27

### Text on the board
tValues: + | + | +